# EAGLE design quadcopter (EAGLE 8.1.1)
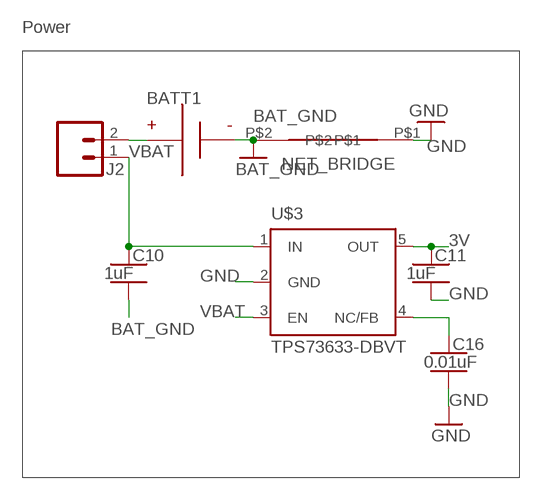
[diagram p0: schematic, sheet 1, part 1 of 2]
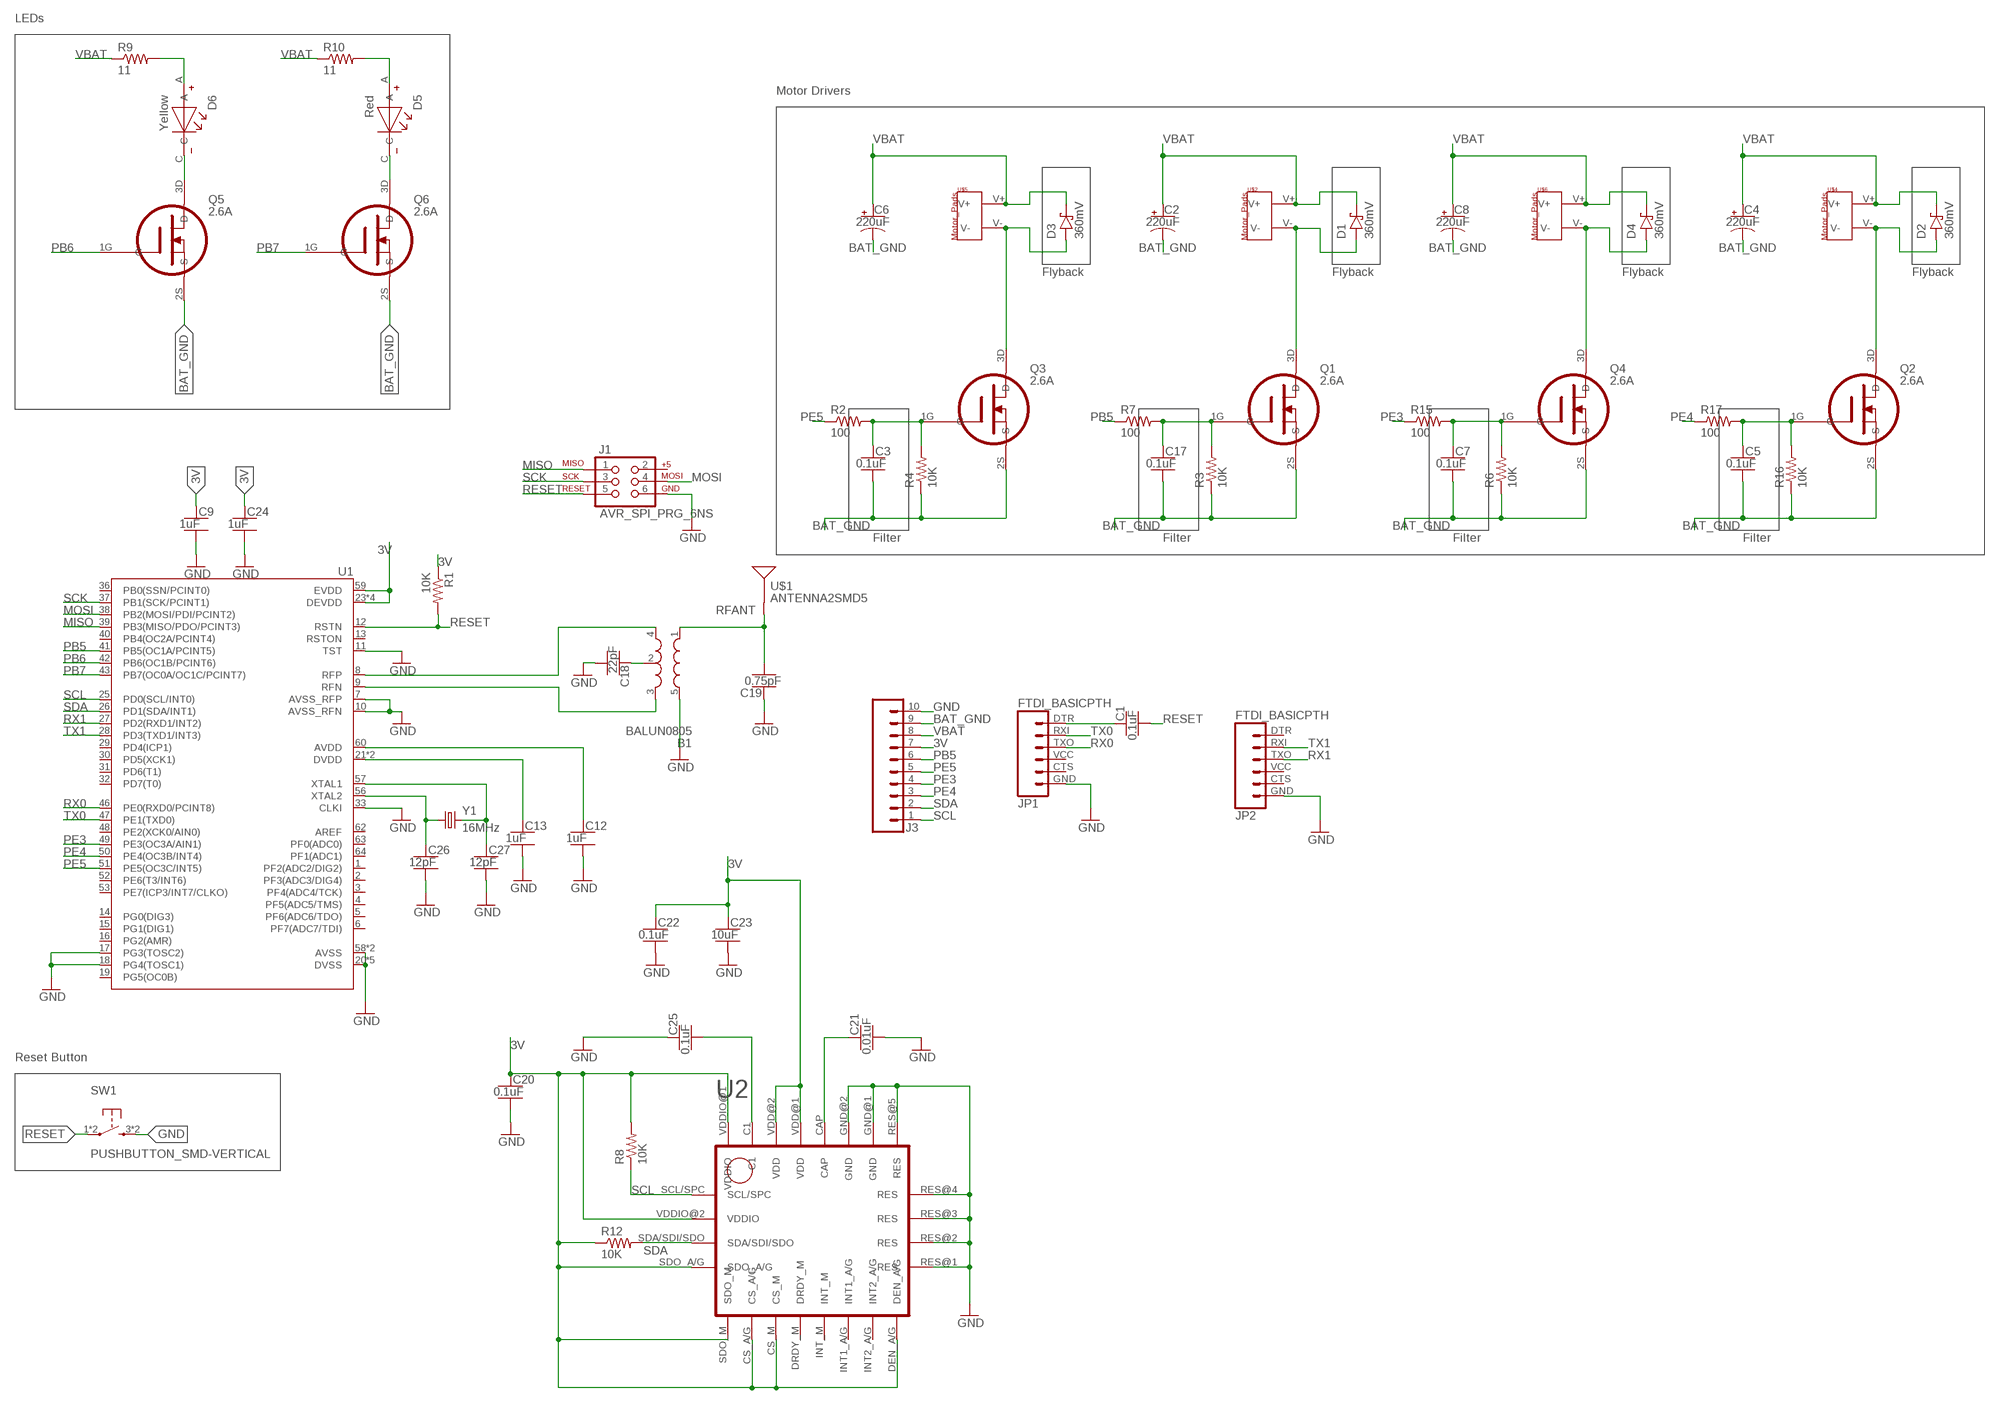
[diagram p1: schematic, sheet 1, part 2 of 2]

## Parts
B1  BALUN0805  [BALUN]
BATT1  BATTERY-HUBSAN-W/HOLDER  [BATTERY-W/HOLDER-380MAH-HUBSAN]
C1  0.1uF  CERAMIC_CAP-0805-0.1UF  [CERAMIC_CAP_0805]
C2  220uF  CAPACITOR-POL_SMD-7043-D_TANTALUM-220UF  [CAPMP7343X310_HS]
C3  0.1uF  CAPACITOR-NP_SMD-2012-0805_CERAMIC-0.1UF  [CAPC2012X140_HS]
C4  220uF  CAPACITOR-POL_SMD-7043-D_TANTALUM-220UF  [CAPMP7343X310_HS]
C5  0.1uF  CAPACITOR-NP_SMD-2012-0805_CERAMIC-0.1UF  [CAPC2012X140_HS]
C6  220uF  CAPACITOR-POL_SMD-7043-D_TANTALUM-220UF  [CAPMP7343X310_HS]
C7  0.1uF  CAPACITOR-NP_SMD-2012-0805_CERAMIC-0.1UF  [CAPC2012X140_HS]
C8  220uF  CAPACITOR-POL_SMD-7043-D_TANTALUM-220UF  [CAPMP7343X310_HS]
C9  1uF  CAPACITOR-NP_SMD-2012-0805_CERAMIC-1UF  [CAPC2012X140_HS]
C10  1uF  CAPACITOR-NP_SMD-2012-0805_CERAMIC-1UF  [CAPC2012X140_HS]
C11  1uF  CAPACITOR-NP_SMD-2012-0805_CERAMIC-1UF  [CAPC2012X140_HS]
C12  1uF  CAPACITOR-NP_SMD-2012-0805_CERAMIC-1UF  [CAPC2012X140_HS]
C13  1uF  CAPACITOR-NP_SMD-2012-0805_CERAMIC-1UF  [CAPC2012X140_HS]
C16  0.01uF  CAPACITOR-NP_SMD-2012-0805_CERAMIC-0.01UF  [CAPC2012X140_HS]
C17  0.1uF  CAPACITOR-NP_SMD-2012-0805_CERAMIC-0.1UF  [CAPC2012X140_HS]
C18  22pF  CAPACITOR-NP_SMD-2012-0805_CERAMIC-22PF  [CAPC2012X140_HS]
C19  0.75pF  CAPACITOR-NP_SMD-2012-0805_CERAMIC-0.75PF  [CAPC2012X140_HS]
C20  0.1uF  CAPACITOR-NP_SMD-2012-0805_CERAMIC-0.1UF  [CAPC2012X140_HS]
C21  0.01uF  CAPACITOR-NP_SMD-2012-0805_CERAMIC-0.01UF  [CAPC2012X140_HS]
C22  0.1uF  CAPACITOR-NP_SMD-2012-0805_CERAMIC-0.1UF  [CAPC2012X140_HS]
C23  10uF  CAPACITOR-NP_SMD-2012-0805_CERAMIC-10UF  [CAPC2012X140_HS]
C24  1uF  CAPACITOR-NP_SMD-2012-0805_CERAMIC-1UF  [CAPC2012X140_HS]
C25  0.1uF  CAPACITOR-NP_SMD-2012-0805_CERAMIC-0.1UF  [CAPC2012X140_HS]
C26  12pF  CAPACITOR-NP_SMD-2012-0805_CERAMIC-12PF  [CAPC2012X140_HS]
C27  12pF  CAPACITOR-NP_SMD-2012-0805_CERAMIC-12PF  [CAPC2012X140_HS]
D1  360mV  DIODE-SCHOTTKY_SMD-SOD123-360MV  [SOD3716X135_HS]
D2  360mV  DIODE-SCHOTTKY_SMD-SOD123-360MV  [SOD3716X135_HS]
D3  360mV  DIODE-SCHOTTKY_SMD-SOD123-360MV  [SOD3716X135_HS]
D4  360mV  DIODE-SCHOTTKY_SMD-SOD123-360MV  [SOD3716X135_HS]
D5  Red  LED_VLMX51Z1AARED  [LED_VLMX51Z1AA]
D6  Yellow  LED_VLMX51Z1AAYELLOW  [LED_VLMX51Z1AA]
J1  AVR_SPI_PRG_6NS  [2X3-NS]
J2  MALE_HEADER_2POS-2X1-0.1IN  [MALE_HEADER_2X1_0.1IN]
J3  SIP-10_TH-254X10  [HDRV10W63P254_10X1_2540X254H838_HS]
JP1  FTDI_BASICPTH  [FTDI_BASIC]
JP2  FTDI_BASICPTH  [FTDI_BASIC]
NET_BRIDGE  NET_BRIDGE  [NET_BRIDGE]
Q1  2.6A  N_MOSFET_SI2302CDS_T1_E3  [N_MOSFET_SI2302CDS_T1_E3]
Q2  2.6A  N_MOSFET_SI2302CDS_T1_E3  [N_MOSFET_SI2302CDS_T1_E3]
Q3  2.6A  N_MOSFET_SI2302CDS_T1_E3  [N_MOSFET_SI2302CDS_T1_E3]
Q4  2.6A  N_MOSFET_SI2302CDS_T1_E3  [N_MOSFET_SI2302CDS_T1_E3]
Q5  2.6A  N_MOSFET_SI2302CDS_T1_E3  [N_MOSFET_SI2302CDS_T1_E3]
Q6  2.6A  N_MOSFET_SI2302CDS_T1_E3  [N_MOSFET_SI2302CDS_T1_E3]
R1  10K  RESISTOR_SMD-2012-0805-10K  [RESC2012X60_HS]
R2  100  RESISTOR_SMD-2012-0805-100  [RESC2012X60_HS]
R3  10K  RESISTOR_SMD-2012-0805-10K  [RESC2012X60_HS]
R4  10K  RESISTOR_SMD-2012-0805-10K  [RESC2012X60_HS]
R6  10K  RESISTOR_SMD-2012-0805-10K  [RESC2012X60_HS]
R7  100  RESISTOR_SMD-2012-0805-100  [RESC2012X60_HS]
R8  10K  RESISTOR_SMD-2012-0805-10K  [RESC2012X60_HS]
R9  11  RESISTOR_SMD-2012-0805-11  [RESC2012X60_HS]
R10  11  RESISTOR_SMD-2012-0805-11  [RESC2012X60_HS]
R12  10K  RESISTOR_SMD-2012-0805-10K  [RESC2012X60_HS]
R15  100  RESISTOR_SMD-2012-0805-100  [RESC2012X60_HS]
R16  10K  RESISTOR_SMD-2012-0805-10K  [RESC2012X60_HS]
R17  100  RESISTOR_SMD-2012-0805-100  [RESC2012X60_HS]
SW1  PUSHBUTTON_SMD-VERTICAL  [TE_FSM8JSMA_HS]
U1  ATMEGA128RFA1  [QFN-64]
U2  IMU_LSM9DS1TR  [IMU_LSM9DS1TR]
U$1  ANTENNA2SMD5  [ANTENNA-CHIP5]
U$2  MOTOR_PADS  [MOTOR_PADS]
U$3  TPS73633-DBVT  [SOT23-DBV]
U$4  MOTOR_PADS  [MOTOR_PADS]
U$5  MOTOR_PADS  [MOTOR_PADS]
U$6  MOTOR_PADS  [MOTOR_PADS]
Y1  16MHz  CRYSTAL5X3  [CRYSTAL-SMD-5X3]

## Nets
3V: C9.1 C11.1 C20.1 C22.1 C23.1 C24.1 J3.7 R1.1 R8.2 R12.1 U1.23(DEVDD) U1.34(DEVDD) U1.44(DEVDD) U1.54(DEVDD) U1.59(EVDD) U2.CS_A/G U2.CS_M U2.DEN_A/G U2.SDO_A/G U2.SDO_M U2.VDD@1(VDD) U2.VDD@2(VDD) U2.VDDIO@1(VDDIO) U2.VDDIO@2(VDDIO) U$3.5(OUT)
BAT_GND [HIGHCURRENT]: BATT1.-(N) C2.2(-) C3.2 C4.2(-) C5.2 C6.2(-) C7.2 C8.2(-) C10.2 C17.2 J3.9 NET_BRIDGE.P$2 Q1.2S(S) Q2.2S(S) Q3.2S(S) Q4.2S(S) Q5.2S(S) Q6.2S(S) R3.1 R4.1 R6.1 R16.1
FILTERED [HIGHCURRENT]: C7.1 Q4.1G(G) R6.2 R15.2
GND: B1.5(GND) C9.2 C11.2 C12.2 C13.2 C16.2 C18.2 C19.1 C20.2 C21.2 C22.2 C23.2 C24.2 C25.1 C26.2 C27.2 J1.6 J3.10 JP1.GND JP2.GND NET_BRIDGE.P$1 SW1.3 SW1.4 U1.7(AVSS_RFP) U1.10(AVSS_RFN) U1.11(TST) U1.17(PG3(TOSC2)) U1.18(PG4(TOSC1)) U1.20(DVSS) U1.24(DVSS) U1.33(CLKI) U1.35(DVSS) U1.45(DVSS) U1.55(DVSS) U1.58(AVSS) U1.61(AVSS) U2.GND@1(GND) U2.GND@2(GND) U2.RES@1(RES) U2.RES@2(RES) U2.RES@3(RES) U2.RES@4(RES) U2.RES@5(RES) U$3.2(GND)
MISO: J1.1 U1.39(PB3(MISO/PDO/PCINT3))
MOSI: J1.4 U1.38(PB2(MOSI/PDI/PCINT2))
N$1: C1.1 JP1.DTR
N$2 [HIGHCURRENT]: D6.C Q5.3D(D)
N$3 [HIGHCURRENT]: D6.A R9.2
N$4 [HIGHCURRENT]: D5.C Q6.3D(D)
N$5: C27.1 U1.57(XTAL1) Y1.3
N$6 [HIGHCURRENT]: D5.A R10.2
N$10: C12.1 U1.60(AVDD)
N$13: C13.1 U1.21(DVDD) U1.22(DVDD)
N$14: C26.1 U1.56(XTAL2) Y1.1
N$15: C25.2 U2.C1
N$16 [HIGHCURRENT]: D1.A Q1.3D(D) U$2.V-
N$17: C21.1 U2.CAP
N$21: B1.4(OUT1) U1.8(RFP)
N$22: B1.3(OUT2) U1.9(RFN)
N$23 [HIGHCURRENT]: BATT1.+(P) J2.2
N$24 [HIGHCURRENT]: D3.A Q3.3D(D) U$5.V-
N$25: B1.2(GND) C18.1
N$29 [HIGHCURRENT]: D4.A Q4.3D(D) U$6.V-
N$30 [HIGHCURRENT]: D2.A Q2.3D(D) U$4.V-
N$31 [HIGHCURRENT]: C3.1 Q3.1G(G) R2.2 R4.2
N$32: C16.1 U$3.4(NC/FB)
N$33 [HIGHCURRENT]: C17.1 Q1.1G(G) R3.2 R7.2
N$34 [HIGHCURRENT]: C5.1 Q2.1G(G) R16.2 R17.2
PB5: J3.6 R7.1 U1.41(PB5(OC1A/PCINT5))
PB6: Q5.1G(G) U1.42(PB6(OC1B/PCINT6))
PB7: Q6.1G(G) U1.43(PB7(OC0A/OC1C/PCINT7))
PE3: J3.4 R15.1 U1.49(PE3(OC3A/AIN1))
PE4: J3.3 R17.1 U1.50(PE4(OC3B/INT4))
PE5: J3.5 R2.1 U1.51(PE5(OC3C/INT5))
RESET: C1.2 J1.5 R1.2 SW1.1 SW1.2 U1.12(RSTN)
RFANT [RFSIG]: B1.1(IN) C19.2 U$1.FEED(SIGNAL)
RX0: JP1.TXO U1.46(PE0(RXD0/PCINT8))
RX1: JP2.TXO U1.27(PD2(RXD1/INT2))
SCK: J1.3 U1.37(PB1(SCK/PCINT1))
SCL: J3.1 R8.1 U1.25(PD0(SCL/INT0)) U2.SCL/SPC
SDA: J3.2 R12.2 U1.26(PD1(SDA/INT1)) U2.SDA/SDI/SDO
TX0: JP1.RXI U1.47(PE1(TXD0))
TX1: JP2.RXI U1.28(PD3(TXD1/INT3))
VBAT [HIGHCURRENT]: C2.1(+) C4.1(+) C6.1(+) C8.1(+) C10.1 D1.C D2.C D3.C D4.C J2.1 J3.8 R9.1 R10.1 U$2.V+ U$3.1(IN) U$3.3(EN) U$4.V+ U$5.V+ U$6.V+
Unconnected: J1.2 JP1.CTS JP1.VCC JP2.CTS JP2.DTR JP2.VCC U1.1(PF2(ADC2/DIG2)) U1.2(PF3(ADC3/DIG4)) U1.3(PF4(ADC4/TCK)) U1.4(PF5(ADC5/TMS)) U1.5(PF6(ADC6/TDO)) U1.6(PF7(ADC7/TDI)) U1.13(RSTON) U1.14(PG0(DIG3)) U1.15(PG1(DIG1)) U1.16(PG2(AMR)) U1.19(PG5(OC0B)) U1.29(PD4(ICP1)) U1.30(PD5(XCK1)) U1.31(PD6(T1)) U1.32(PD7(T0)) U1.36(PB0(SSN/PCINT0)) U1.40(PB4(OC2A/PCINT4)) U1.48(PE2(XCK0/AIN0)) U1.52(PE6(T3/INT6)) U1.53(PE7(ICP3/INT7/CLKO)) U1.62(AREF) U1.63(PF0(ADC0)) U1.64(PF1(ADC1)) U2.DRDY_M U2.INT1_A/G U2.INT2_A/G U2.INT_M

## Notes on the sheet
- LEDs
- Motor Drivers
- Flyback | Flyback | Flyback | Flyback
- Power
- Filter | Filter | Filter | Filter
- Reset Button

## Library data of the parts
B1 = quadparts_prebuilt:BALUN: 0805 footprint balun- Ember 351/357; DATASHEET: http://katalog.we-online.de/pbs/datasheet/748421245.pdf; DIST: Digikey; DISTPN: 732-2230-6-ND; MFR: Wurth Electronics Inc; MPN: 748421245; PRICE: 2.63
BATT1 = quadparts_prebuilt:BATTERY; CREATOR: Swanson; DIST: AMAZON; DISTPN: http://www.amazon.com/dp/B00RROB6Q4?smid=AMNTPWSAB5H0S; MFR: HUBSAN; MPN: X4-H107C-8-in-1
C1 = quadparts_connie:CERAMIC_CAP: Nonpolarized capacitor; CREATOR: SWANSON; DIST: Digikey; DISTPN: 490-1666-1-ND; MFR: Murata Electronics North America; MPN: GRM21BR71H104KA01L
C2 C4 C6 C8 = quadparts_prebuilt:CAPACITOR-POL_: Polarized capacitor; DIST: Digikey; DISTPN: 478-8912-1-ND; MFR: AVX Corporation; MPN: TAJD227K006RNJ
C3 C5 C7 C17 C20 C22 C25 = quadparts_prebuilt:CAPACITOR-NP_: Nonpolarized capacitor; DIST: Digikey; DISTPN: 490-1666-1-ND; MFR: Murata Electronics North America; MPN: GRM21BR71H104KA01L
C9-C13 C24 = quadparts_prebuilt:CAPACITOR-NP_: Nonpolarized capacitor; DIST: Digikey; DISTPN: 490-4736-1-ND; MFR: Murata Electronics North America; MPN: GRM21BR71H105KA12L
C16 C21 = quadparts_prebuilt:CAPACITOR-NP_: Nonpolarized capacitor; DIST: Digikey; DISTPN: 490-8295-1-ND; MFR: Murata Electronics North America; MPN: GRM2195C1H103FA01D
C18 = quadparts_prebuilt:CAPACITOR-NP_: Nonpolarized capacitor; DIST: Digikey; DISTPN: 490-5534-1-ND; MFR: Murata Electronics North America; MPN: GRM21A5C2E220JW01D
C19 = quadparts_prebuilt:CAPACITOR-NP_: Nonpolarized capacitor; DIST: Digikey; DISTPN: 490-3585-1-ND; MFR: Murata Electronics North America; MPN: GQM2195C2AR75CB01D
C23 = quadparts_prebuilt:CAPACITOR-NP_: Nonpolarized capacitor; DIST: Digikey; DISTPN: 490-5523-1-ND; MFR: Murata Electronics North America; MPN: GRM21BR61E106KA73L
C26 C27 = quadparts_prebuilt:CAPACITOR-NP_: Nonpolarized capacitor; DIST: Digikey; DISTPN: 490-5531-1-ND; MFR: Murata Electronics North America; MPN: GRM21A5C2E120JW01D
D1-D4 = quadparts_prebuilt:DIODE-SCHOTTKY_: Schottky diode; DIST: Digikey; DISTPN: CRS08QMCT-ND; MFR: Toshiba Semiconductor and Storage; MPN: CRS08(TE85L,Q,M)
D5 = LEDs:LED_VLMX51Z1AA: 2.2V, 140mA test, 200mA max; CREATOR: Jason Shiuan; DIST: Digikey; DISTPN: VLMR51Z1AA-GS08CT-ND; MFR: Vishay; MPN: VLMR51Z1AA-GS08
D6 = LEDs:LED_VLMX51Z1AA: 2.2V, 140mA test, 200mA max; CREATOR: Jason Shiuan; DIST: Digikey; DISTPN: VLMY51Z1AA-GS08CT-ND; MFR: Vishay; MPN: VLMY51Z1AA-GS08
J1 = quadparts_prebuilt:AVR_SPI_PRG_6: AVR ISP 6 Pin This is the reduced ISP connector for AVR programming. Common on Arduino. This footprint will take up less PCB space and can be used with a 10-pin to 6-pin adapter such as SKU: BOB-08508; DATASHEET: http://portal.fciconnect.com/Comergent//fci/drawing/67996.pdf; DIST: Digikey; DISTPN: 609-3234-ND; MFR: Amphenol FCI; MPN: 67997-206HLF; PRICE: 0.31
J2 = quadparts_connie:MALE_HEADER_2POS: 2 pin single inline pin header, socket, or connector; CREATOR: SWANSON; DIST: Digikey; DISTPN: 3M9447-ND; MFR: 3M; MPN: 961102-6404-AR
J3 = quadparts_prebuilt:SIP-10_: 10 pin single inline pin header, socket, or connector; DATASHEET: http://portal.fciconnect.com/Comergent//fci/drawing/68000.pdf; DIST: Digikey; DISTPN: 609-3250-ND; MFR: Amphenol FCI; MPN: 68000-110HLF; PRICE: 0.55
JP1 JP2 = quadparts_prebuilt:FTDI_BASIC: FTDI Basic header with labels; DATASHEET: http://portal.fciconnect.com/Comergent//fci/drawing/68015.pdf; DIST: Digikey; DISTPN: 609-3327-ND; MFR: Amphenol FCI; MPN: 68016-406HLF; PRICE: 0.33
NET_BRIDGE = quadparts_jason:NET_BRIDGE; CREATPR: Jason Shiuan
Q1-Q6 = quadparts_connie:N_MOSFET_SI2302CDS_T1_E3; CREATOR: Connie Du; DIST: Digikey; DISTPN: SI2302CDS-T1-E3CT-ND; MFR: Vishay Siliconix; MPN: SI2302CDS-T1-E3
R1 R3 R4 R6 R8 R12 R16 = quadparts_prebuilt:RESISTOR_: Resistor; DIST: Digikey; DISTPN: 311-10KARCT-ND; MFR: Yageo; MPN: RC0805JR-0710KL
R2 R7 R15 R17 = quadparts_prebuilt:RESISTOR_: Resistor; DIST: Digikey; DISTPN: 311-100ARCT-ND; MFR: Yageo; MPN: RC0805JR-07100RL
R9 R10 = quadparts_prebuilt:RESISTOR_: Resistor; DIST: Digikey; DISTPN: 311-11.0FRCT-ND; MFR: Yageo; MPN: RC1206FR-0711RL
SW1 = quadparts_prebuilt:PUSHBUTTON_: Pushbutton with 2 pins shorting 1 to 2 and two extra mounting pins 3 & 4
U1 = quadparts_prebuilt:ATMEGA128RFA1: ATmega128RFA1 8-bit AVR Microcontroller with Low Power 2.4GHz Transceiver for ZigBee and IEEE 802.15.4; CREATOR: Swanson; DATASHEET: http://www.atmel.com/Images/Atmel-8266-MCU_Wireless-ATmega128RFA1_Datasheet.pdf; DIST: Digikey; DISTPN: ATMEGA128RFA1-ZUR00DKR-ND; MFR: Atmel; MPN: ATMEGA128RFA1-ZUR00; PRICE: 10.21
U2 = quadparts_connie:IMU_LSM9DS1TR; CREATOR: Connie Du; DIST: Digikey; DISTPN: 497-14946-1-ND; MFR: STMicroelectronics; MPN: LSM9DS1TR
U$1 = quadparts_prebuilt:ANTENNA2: Chip antenna Single endded antenna. Common with smaller chip antennas. CHIP4 package is the GPS Chip Antenna SKU: GPS-08418. CHIP5 package is 2.4GHz chip antenna SKU: WRL-00144.; DATASHEET: http://www.linxtechnologies.com/resources/data-guides/ant-xxx-chp-x.pdf; DIST: Digikey; DISTPN: ANT-2.45-CHPCT-ND; MFR: Linx Technologies Inc.; MPN: ANT-2.45-CHP-T; PRICE: 3.16
U$2 U$4-U$6 = quadparts_prebuilt:MOTOR_PADS; DIST: NA; DISTPN: NA; MFR: NA; MPN: NA
U$3 = quadparts_prebuilt:TPS73633-DBVT; DATASHEET: http://www.ti.com/lit/ds/symlink/lp3985.pdf; DIST: Digikey; DISTPN: LP3985IM5X-3.0/NOPBCT-ND; MFR: Texas Instruments; MPN: LP3985IM5X-3.0/NOPB; PRICE: 0.59
Y1 = quadparts_prebuilt:CRYSTAL: Various standard crystals. Proven footprints.; DATASHEET: http://www.abracon.com/Resonators/abm3b.pdf; DIST: Digikey; DISTPN: 535-9122-1-ND; MFR: Abracon LLC; MPN: ABM3B-16.000MHZ-B2-T; PRICE: 0.68; PROD_ID: XTAL-08218

## Net classes
1 RFSIG: width 0.457 mm
2 HIGHCURRENT: width 0.457 mm

## Board
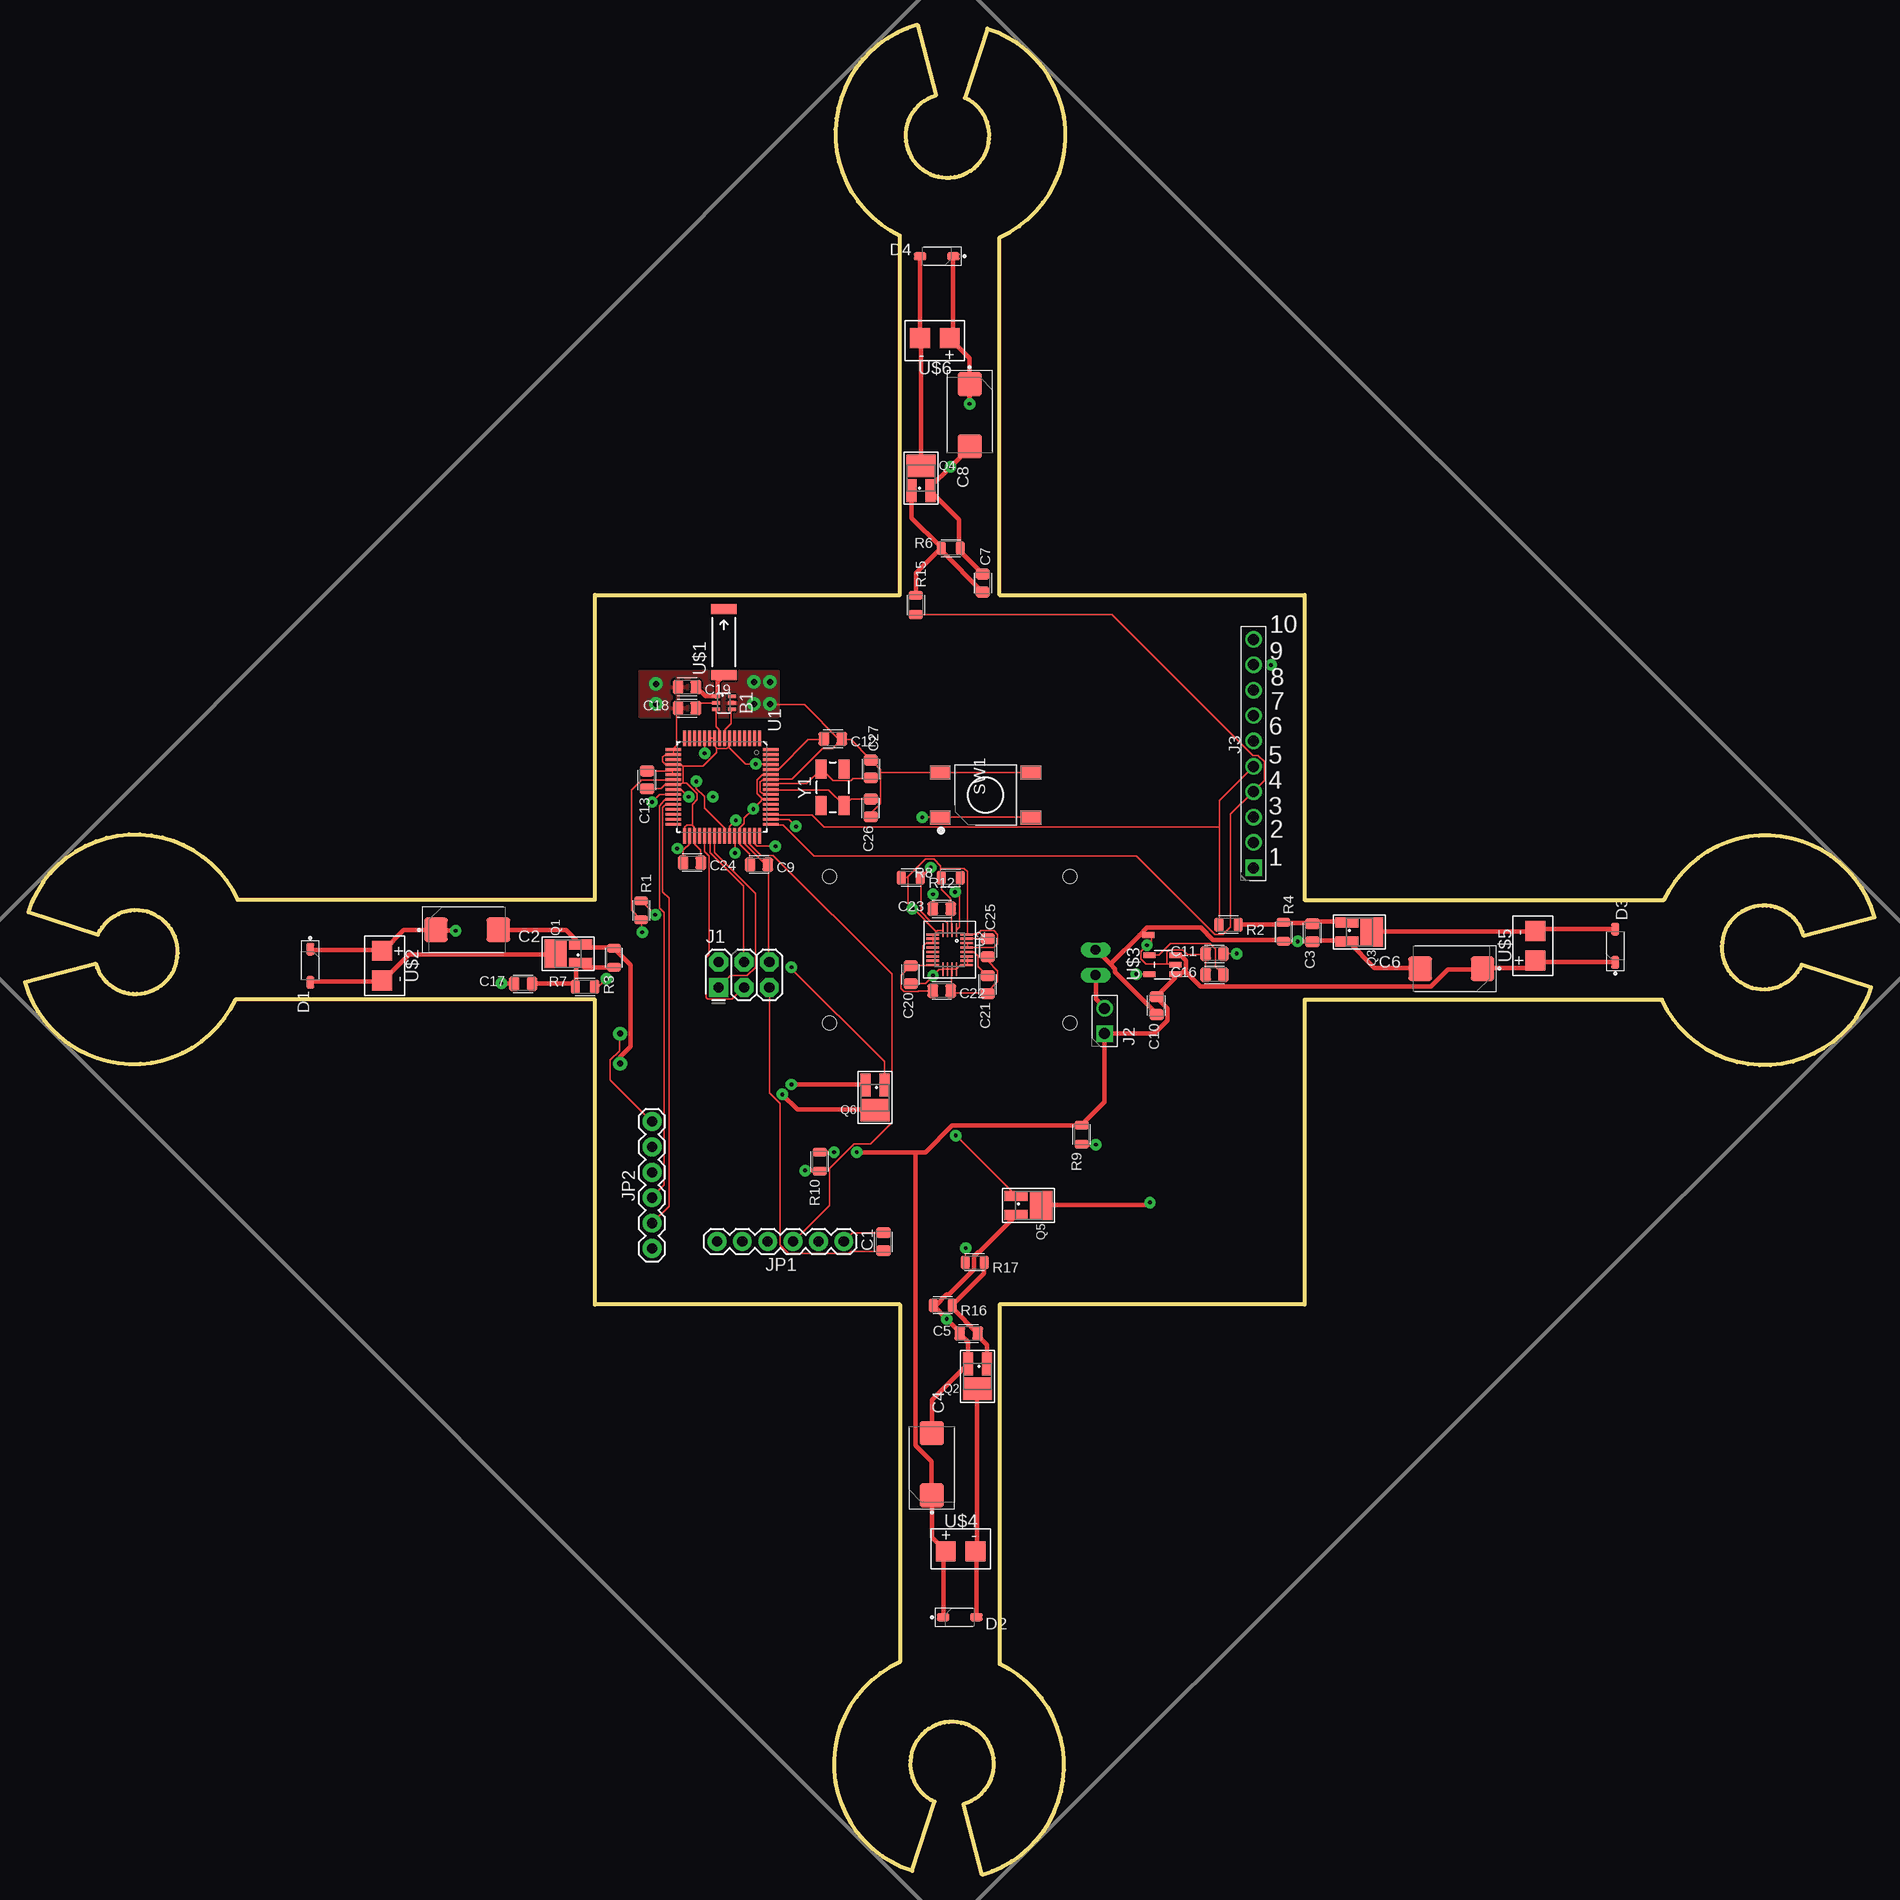
[diagram p2: board, top side]
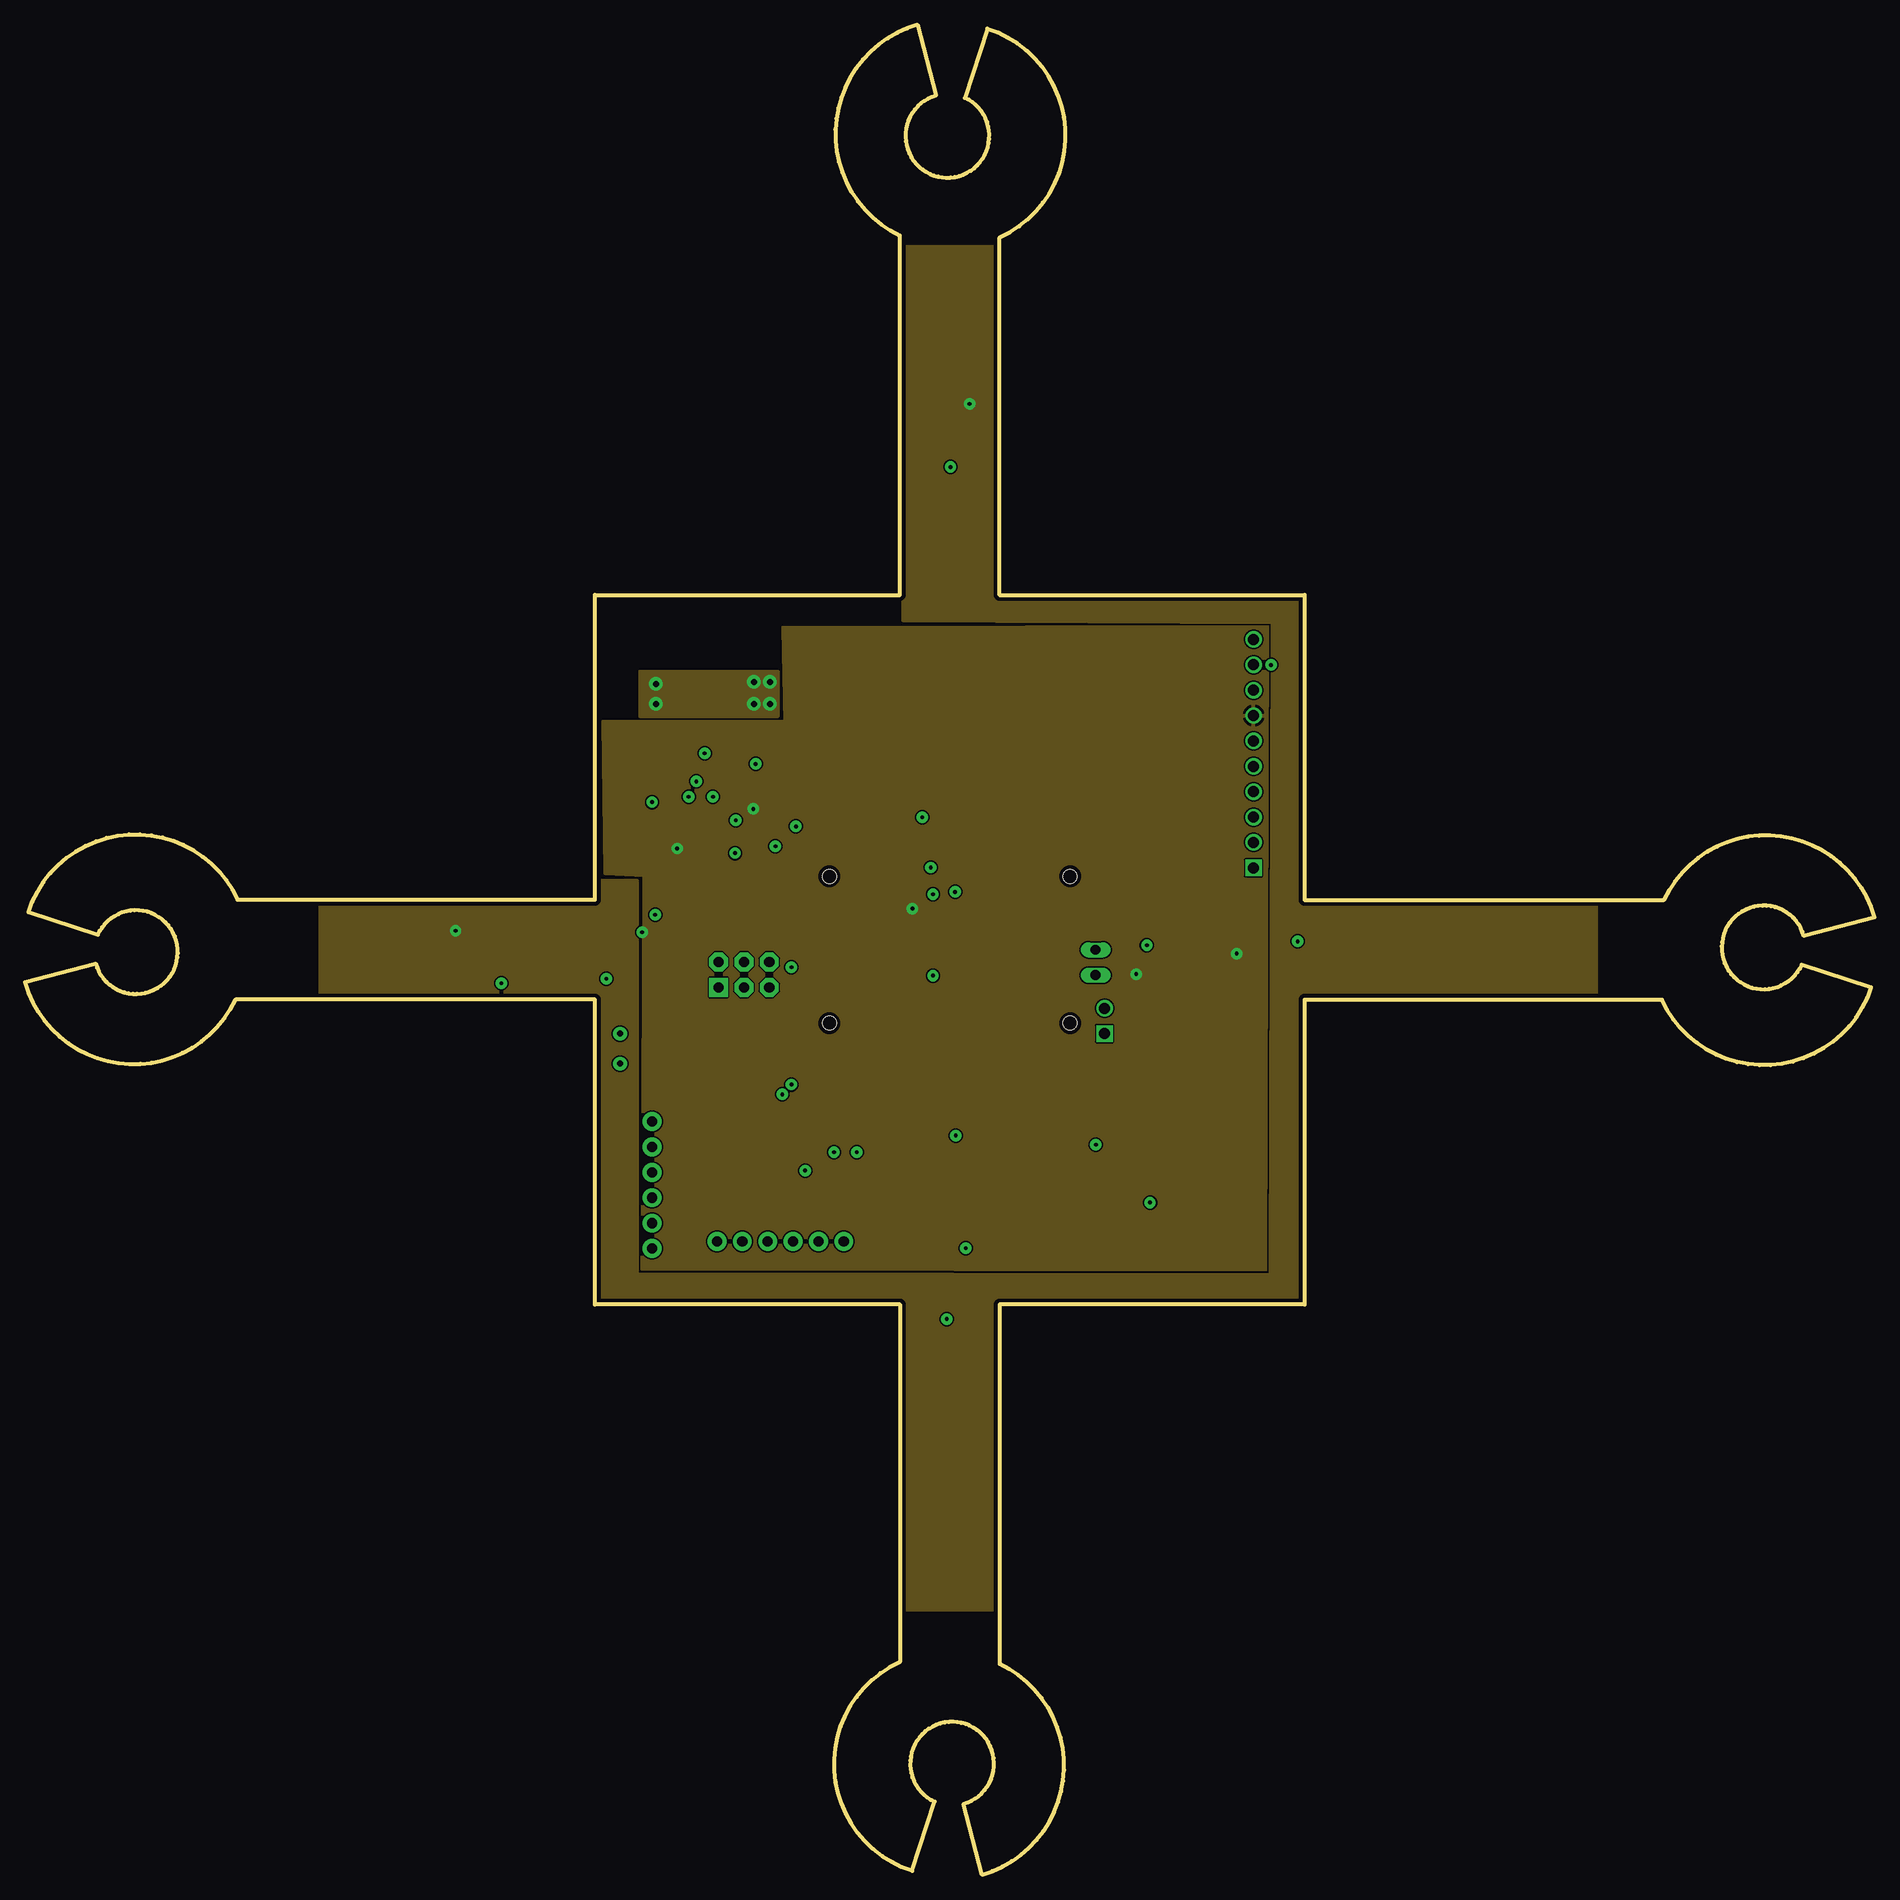
[diagram p3: board, inner layer Route2]
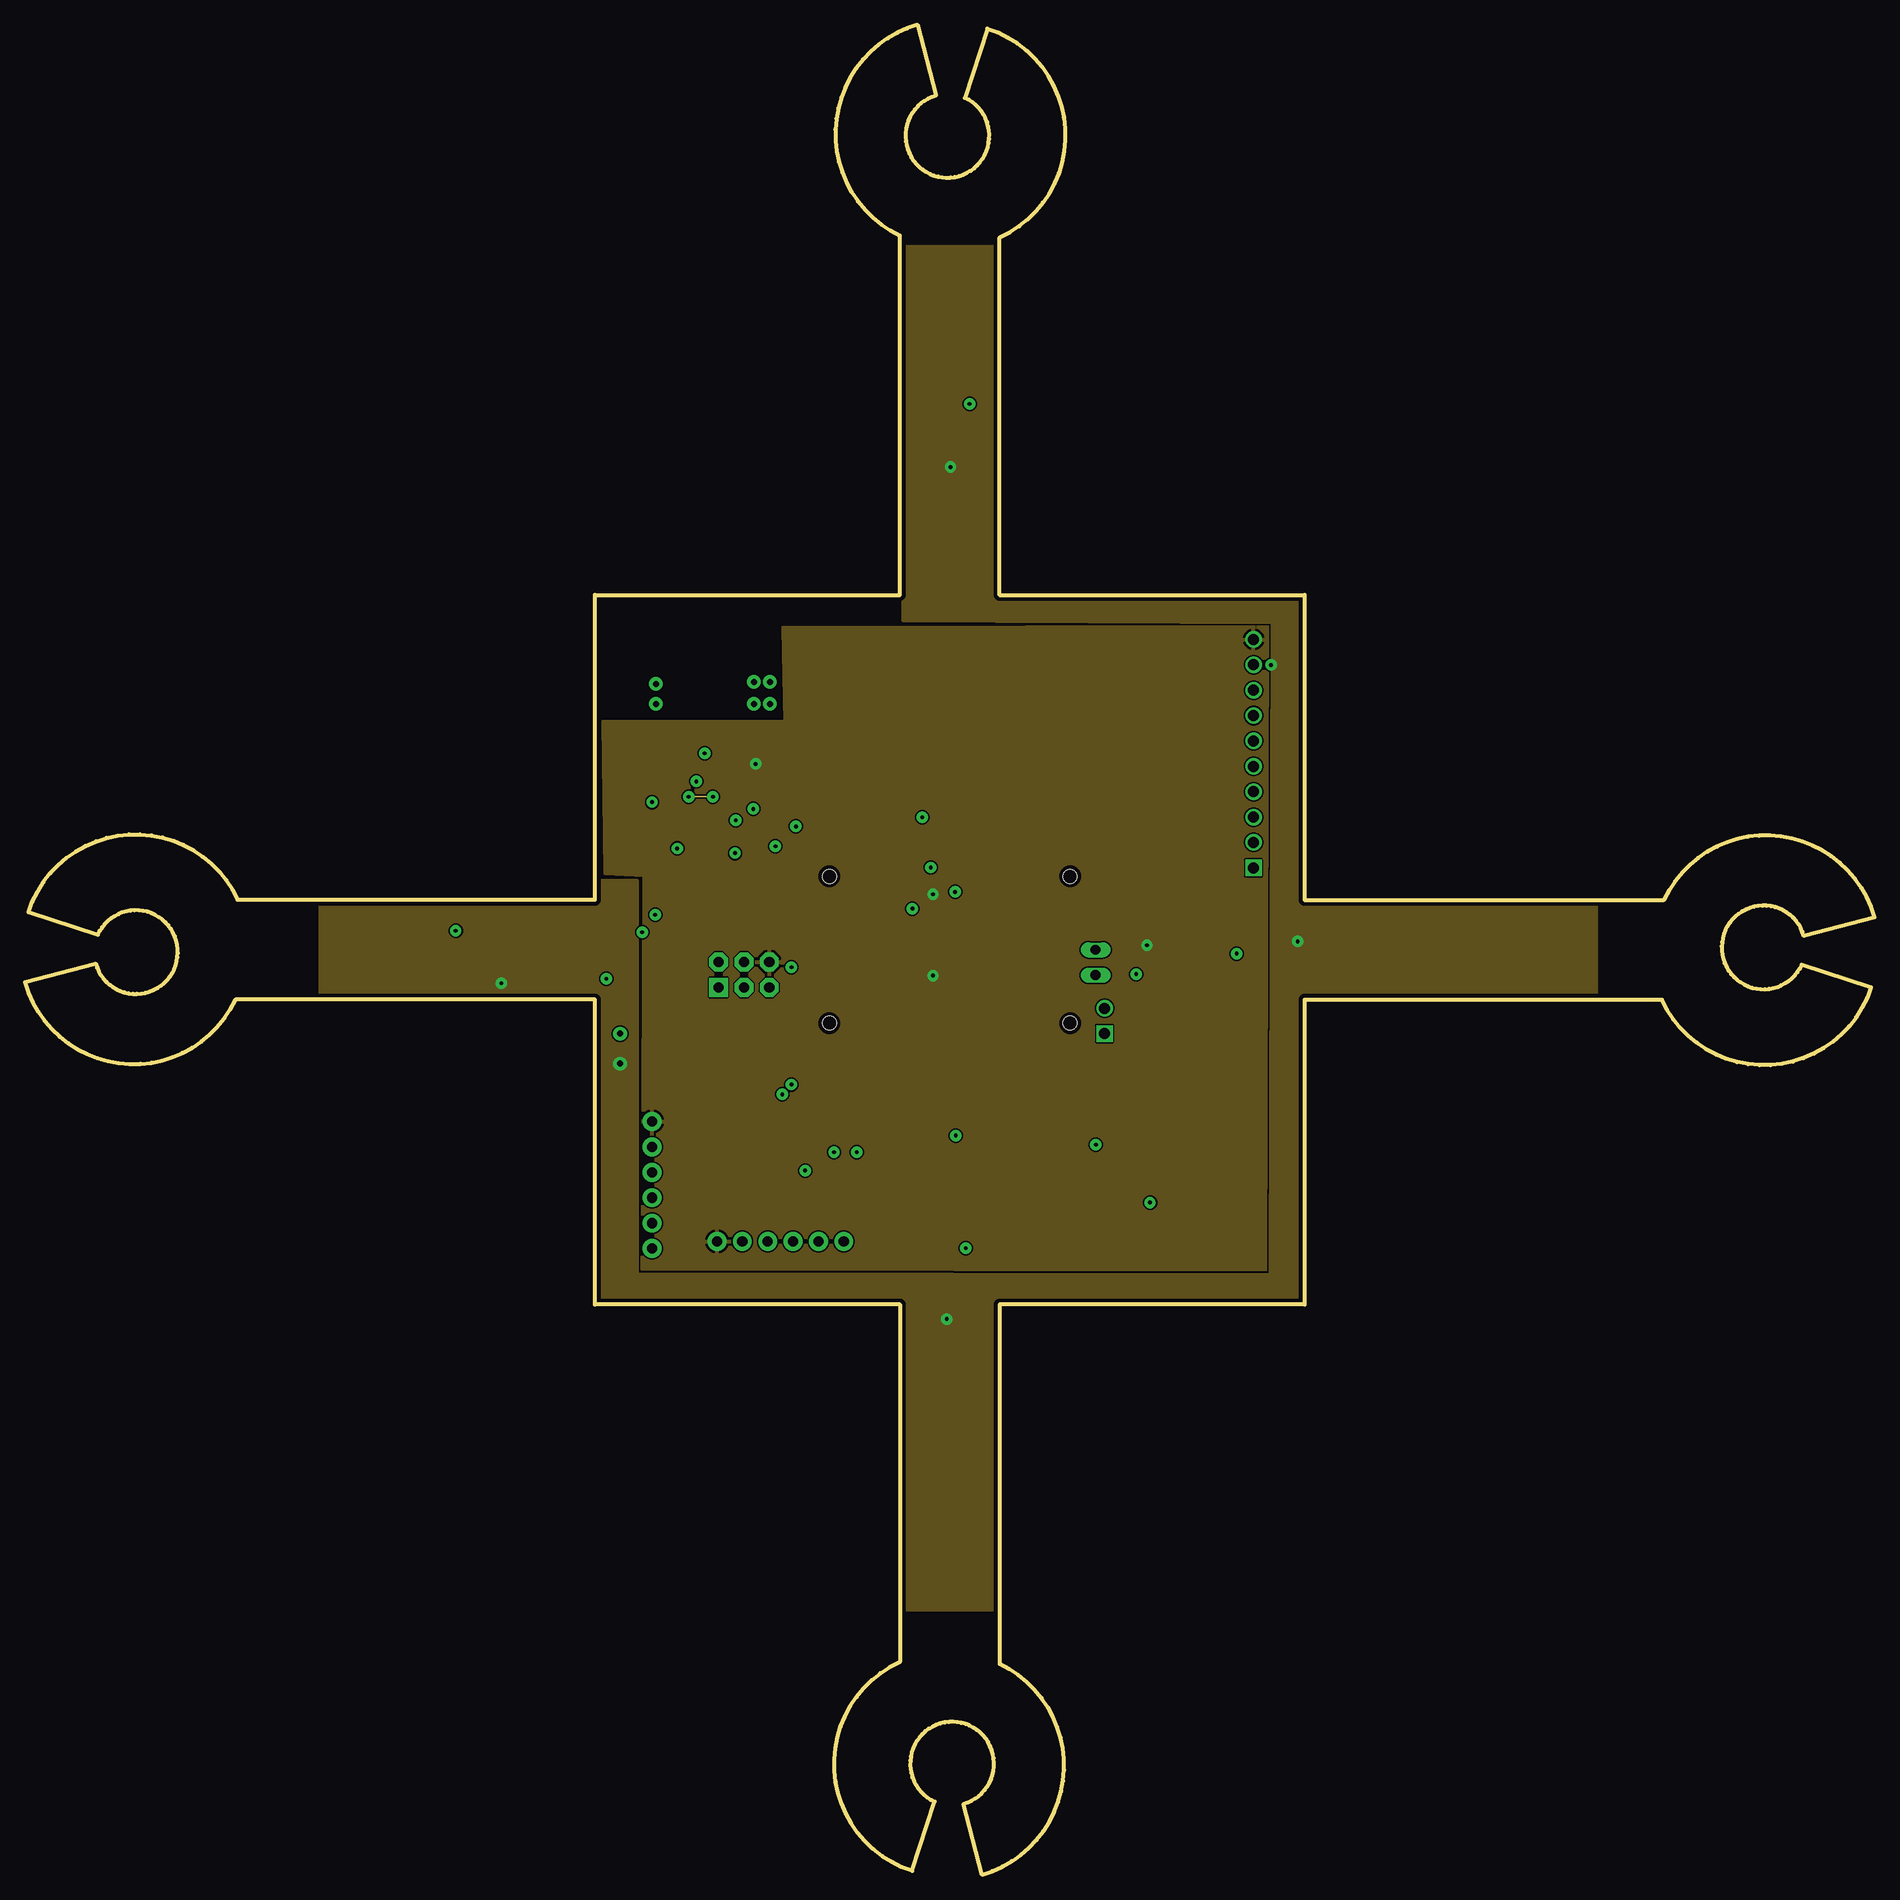
[diagram p4: board, inner layer Route15]
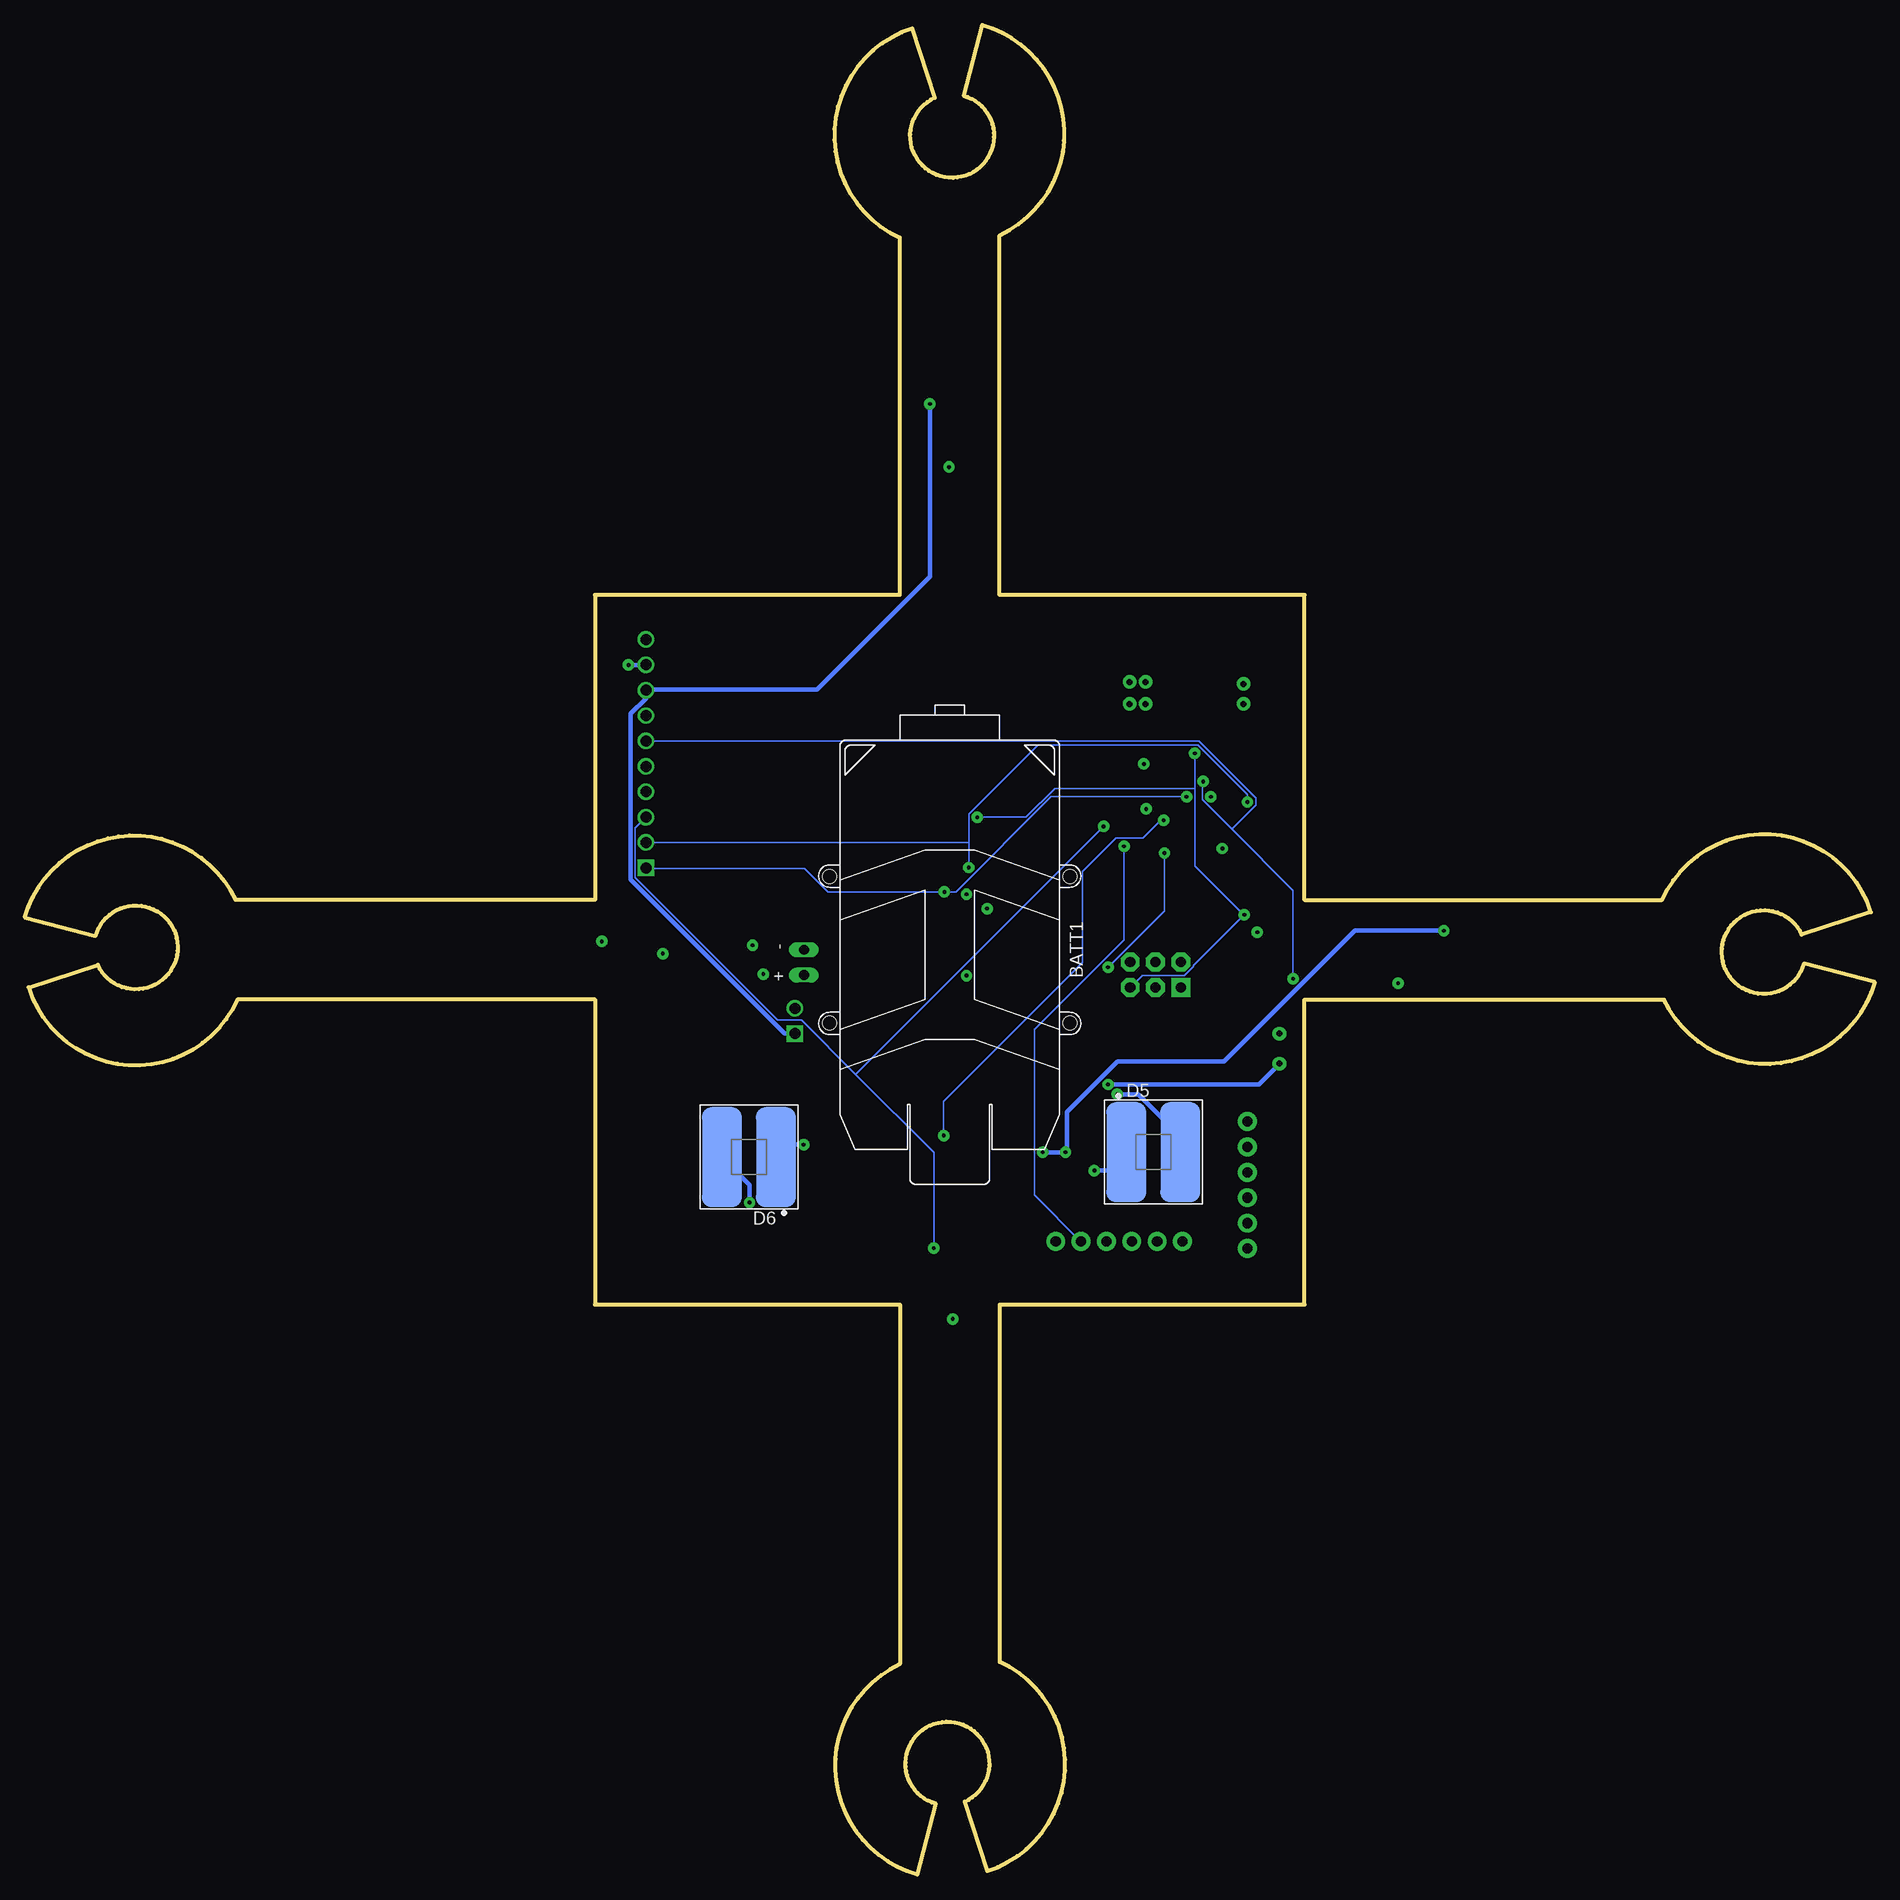
[diagram p5: board, bottom side, seen from below]

Size 185.12 x 185.12 mm. Coordinates in mm from the lower left corner, seen from the top.
Outline: 128.06,87.56 163.84,87.56 arc138 184.77,88.79 177.84,91.06 arc-319 178.05,93.95 185.12,95.79 arc139 164.05,97.56 128.06,97.56 128.06,128.06 97.56,128.06 97.56,163.84 arc138 96.33,184.77 94.07,177.84 arc-319 91.17,178.05 89.33,185.12 arc139 87.56,164.05 87.56,128.06 57.06,128.06 57.06,97.56 21.28,97.56 arc138 0.35,96.33 7.28,94.07 arc-319 7.07,91.17 0,89.33 arc139 21.07,87.56 57.06,87.56 57.06,57.06 87.56,57.06 87.56,21.28 arc138 88.79,0.35 91.06,7.28 arc-319 93.95,7.07 95.79,0 arc139 97.56,21.07 97.56,57.06 128.06,57.06 128.06,87.56
Copper layers (1*2*15*16): Top 0.035559375mm / dielectric 1.501140625mm / Route2 0.035559375mm / dielectric 0.149859375mm / Route15 0.035559375mm / dielectric 0.200659375mm / Bottom 0.035559375mm
Design rules "jason_connie_4pcb-66board": minimum track width 6mil, minimum drill 15mil, track to track 6mil, track to pad 6mil, pad to pad 6mil, via to via 6mil, smd to smd 6mil, copper to edge 15mil, drill to drill 10mil, minimum pad ring 10mil, minimum via ring 15mil, stop-mask expansion 4mil, vias tented up to drill 0mil, thermal gap 10mil
tRestrict: area 91.9,91.7 to 93.3,93.5; area 57.8,121 to 75.2,127.8
bRestrict: area 91.9,91.7 to 93.3,93.5; area 57.8,121 to 75.2,127.8

### Footprints (pad centres in the part's own frame; a part is rotated, then mirrored left to right if it is on the bottom)
BALUN = smd 0.35 x 0.8: 1 -0.65,-0.8; 2 0,-0.8; 3 0.65,-0.8; 4 0.65,0.8; 5 0,0.8; 6 -0.65,0.8
BATTERY-W/HOLDER-380MAH-HUBSAN = drill 1 long: + -2.54,14.605; - 0,14.605 | hole 1.4: -7.35,-12.05; -7.35,12.05; 7.35,-12.05; 7.35,12.05
CERAMIC_CAP_0805 = smd 1.08 x 1.42: 1 -0.895,0; 2 0.895,0
CAPMP7343X310_HS = smd 2.37 x 2.43: 1 -3.12,0; 2 3.12,0
CAPC2012X140_HS = smd 1.08 x 1.42: 1 -0.895,0; 2 0.895,0
SOD3716X135_HS = smd 1.25 x 0.8: A 1.665,0; C -1.665,0
LED_VLMX51Z1AA = smd 4 x 10: A -2.7,0; C 2.7,0
2X3-NS = drill 1.016 pad 1.88 square: 1 -2.54,-1.27 | drill 1.016 pad 1.88 octagon: 2 -2.54,1.27; 3 0,-1.27; 4 0,1.27; 5 2.54,-1.27; 6 2.54,1.27
MALE_HEADER_2X1_0.1IN = drill 1.1 pad 1.65 square: 1 0,0 | drill 1.1 pad 1.65: 2 2.54,0
HDRV10W63P254_10X1_2540X254H838_HS = drill 1.1 pad 1.65 square: 1 0,0 | drill 1.1 pad 1.65: 2 2.54,0; 3 5.08,0; 4 7.62,0; 5 10.16,0; 6 12.7,0; 7 15.24,0; 8 17.78,0; 9 20.32,0; 10 22.86,0
FTDI_BASIC = drill 1.016 pad 1.88: CTS 10.16,0; DTR 0,0; GND 12.7,0; RXI 2.54,0; TXO 5.08,0; VCC 7.62,0
NET_BRIDGE = smd 0.6 x 0.6: P$1 -0.3,0; P$2 0.3,0
N_MOSFET_SI2302CDS_T1_E3 = smd 1 x 2.3: 1G -0.95,-1.25; 2S 0.95,-1.25 | smd 2.9 x 2.25: 3D 0,1.25
RESC2012X60_HS = smd 0.92 x 1.38: 1 -0.955,0; 2 0.955,0
TE_FSM8JSMA_HS = smd 1.4 x 2.1: 1 -2.25,4.55; 2 -2.25,-4.55; 3 2.25,4.55; 4 2.25,-4.55
QFN-64 = smd 1.562 x 0.28: 1 -4.881,3.75; 2 -4.881,3.25; 3 -4.881,2.75; 4 -4.881,2.25; 5 -4.881,1.75; 6 -4.881,1.25; 7 -4.881,0.75; 8 -4.881,0.25; 9 -4.881,-0.25; 10 -4.881,-0.75; 11 -4.881,-1.25; 12 -4.881,-1.75; 13 -4.881,-2.25; 14 -4.881,-2.75; 15 -4.881,-3.25; 16 -4.881,-3.75; 33 4.881,-3.75; 34 4.881,-3.25; 35 4.881,-2.75; 36 4.881,-2.25; 37 4.881,-1.75; 38 4.881,-1.25; 39 4.881,-0.75; 40 4.881,-0.25; 41 4.881,0.25; 42 4.881,0.75; 43 4.881,1.25; 44 4.881,1.75; 45 4.881,2.25; 46 4.881,2.75; 47 4.881,3.25; 48 4.881,3.75 | smd 0.28 x 1.562: 17 -3.75,-4.881; 18 -3.25,-4.881; 19 -2.75,-4.881; 20 -2.25,-4.881; 21 -1.75,-4.881; 22 -1.25,-4.881; 23 -0.75,-4.881; 24 -0.25,-4.881; 25 0.25,-4.881; 26 0.75,-4.881; 27 1.25,-4.881; 28 1.75,-4.881; 29 2.25,-4.881; 30 2.75,-4.881; 31 3.25,-4.881; 32 3.75,-4.881; 49 3.75,4.881; 50 3.25,4.881; 51 2.75,4.881; 52 2.25,4.881; 53 1.75,4.881; 54 1.25,4.881; 55 0.75,4.881; 56 0.25,4.881; 57 -0.25,4.881; 58 -0.75,4.881; 59 -1.25,4.881; 60 -1.75,4.881; 61 -2.25,4.881; 62 -2.75,4.881; 63 -3.25,4.881; 64 -3.75,4.881
IMU_LSM9DS1TR = smd 0.23 x 1.4: C1 -1.1,1.7; CAP 0.22,1.7; CS_A/G -1.1,-1.7; CS_M -0.66,-1.7; DEN_A/G 1.54,-1.7; DRDY_M -0.22,-1.7; GND@1 1.1,1.7; GND@2 0.66,1.7; INT1_A/G 0.66,-1.7; INT2_A/G 1.1,-1.7; INT_M 0.22,-1.7; RES@5 1.54,1.7; SDO_M -1.54,-1.7; VDD@1 -0.22,1.7; VDD@2 -0.66,1.7; VDDIO@1 -1.54,1.7 | smd 1.4 x 0.23: RES@1 1.95,-0.67; RES@2 1.95,-0.223; RES@3 1.95,0.223; RES@4 1.95,0.67; SCL/SPC -1.95,0.67; SDA/SDI/SDO -1.95,-0.223; SDO_A/G -1.95,-0.67; VDDIO@2 -1.95,0.223
ANTENNA-CHIP5 = smd 1.016 x 2.54: FEED -3.302,0; NC 3.302,0
MOTOR_PADS = smd 2 x 2: V+ -1,0; V- 2,0
SOT23-DBV = smd 0.55 x 1.2: 1 -0.95,-1.3; 2 0,-1.3; 3 0.95,-1.3; 4 0.95,1.3; 5 -0.95,1.3
CRYSTAL-SMD-5X3 = smd 1.9 x 1.1: 1 -1.85,-1.15; 2 1.85,-1.15; 3 1.85,1.15; 4 -1.85,1.15

### Placement (x,y rotation side)
B1  69.96,117.26 270 top
BATT1  92.56,92.56 90 bottom
C1  85.93,63.34 270 top
C2  44.26,94.56 0 top
C3  128.86,94.26 270 top
C4  90.76,41.06 90 top
C5  94.46,54.16 180 top
C6  142.76,90.66 180 top
C7  95.86,129.26 90 top
C8  94.56,146.06 270 top
C9  73.46,101.06 0 top
C10  113.26,86.96 270 top
C11  119.06,92.16 180 top
C12  80.86,113.66 0 top
C13  62.26,109.56 270 top
C16  119.06,90.06 180 top
C17  49.86,89.16 180 top
C18  66.26,116.76 180 top
C19  66.26,118.86 0 top
C20  88.66,90.06 270 top
C21  96.36,89.06 270 top
C22  91.76,88.46 0 top
C23  91.76,96.66 180 top
C24  66.76,101.26 0 top
C25  96.36,92.76 90 top
C26  84.66,106.76 270 top
C27  84.66,110.66 90 top
D1  28.56,90.96 270 top
D2  93.56,25.76 0 top
D3  159.16,92.96 90 top
D4  91.26,161.96 180 top
D5  72.19,72.31 0 bottom
D6  112.66,71.81 180 bottom
J1  71.96,90.06 0 top
J2  108.06,84.16 90 top
J3  122.96,100.76 90 top
JP1  81.96,63.36 180 top
JP2  62.76,62.66 90 top
NET_BRIDGE  112.46,94.06 180 top
Q1  54.36,92.16 90 top
Q2  95.36,49.86 180 top
Q3  133.56,94.36 270 top
Q4  89.66,139.76 0 top
Q5  100.46,66.96 270 top
Q6  85.06,77.76 180 top
R1  61.67,96.5 90 top
R2  120.46,95.06 0 top
R3  58.96,91.76 270 top
R4  125.96,94.36 90 top
R6  92.66,132.76 180 top
R7  56.06,88.86 180 top
R8  92.66,99.76 180 top
R9  105.76,74.06 270 top
R10  79.56,71.36 270 top
R12  88.66,99.76 0 top
R15  89.16,127.06 90 top
R16  91.86,56.96 0 top
R17  95.06,61.26 0 top
SW1  96.16,108.06 90 top
U1  69.76,108.86 270 top
U2  92.56,92.56 270 top
U$1  69.96,123.36 90 top
U$2  35.76,91.46 270 top
U$3  113.86,91.06 90 top
U$4  93.16,32.36 0 top
U$5  151.16,92.46 90 top
U$6  91.56,153.76 180 top
Y1  80.85,108.82 90 top

### Tracks (layer width: path | path; a pad name or v marks a point on that pad's centre or on a via)
3V  (via drill 0.38)
  Top 0.152: 91.23,94.35 90.96,94.08 U2.SDO_M 90.88,94.08 90.88,93.7 U2.CS_A/G 90.88,93.63 90.88,93.25 U2.CS_M 90.81,93.17 90.12,93.17 89.89,92.94 89.89,90.96 | 91.23,94.35 91.34,94.47 91.87,94.47 U2.SDO_A/G | 89.89,90.96 88.67,90.96 C20.1 88.6,90.88 87.68,89.97 87.68,88.67 87.99,88.37 89.36,88.37 89.44,88.45 90.81,88.45 C22.1 | 89.89,90.96 90.81,90.96 U2.DEN_A/G | U2.VDD@2 94.31,93.17 94.31,92.79 U2.VDD@1 94.39,92.79 96.98,92.79 97.36,93.17 97.36,94.08 96.98,94.47 95.68,94.47 95.38,94.16 94.31,94.16 | 94.31,94.16 U2.VDDIO@1 | U2.VDDIO@2 92.71,94.54 92.71,96.6 C23.1 92.64,96.68 92.64,97.67 91.72,98.58 91.72,99.72 R8.2 91.65,99.8 91.65,100.71 | 88.33,99.84 90.12,101.63 90.96,101.63 91.65,100.94 91.65,100.71 | 88.33,99.84 88.29,99.8 87.76,99.8 R12.1 | 94.31,94.16 94.31,100.41 94.01,100.71 91.65,100.71 | 88.86,96.71 88.37,97.21 88.37,99.8 88.33,99.84 | 88.86,96.71 91.23,94.35 | 73.78,107.69 73.28,108.18 73.28,109.55 73.82,110.09 74.58,110.09 U1.59 | 73.78,107.69 73.82,107.65 74.58,107.65 U1.54 | C9.1 72.52,101.09 72.52,102.16 71.53,103.15 71.53,103.91 U1.44 71.53,103.99 71.53,104.75 71.99,105.21 71.99,105.74 v72.9,106.66 73.74,107.5 73.74,107.65 73.78,107.69 | 65.93,102.58 66.5,103.15 66.5,103.91 U1.34 | 65.93,102.58 65.89,102.54 65.89,101.32 C24.1 | v111.23,90.12 112.52,90.12 U$3.5 | v61.78,94.31 61.7,94.39 61.7,95.53 R1.1 61.62,95.61 60.71,96.52 60.71,108.56 61.7,109.55 64.82,109.55 U1.23 | v121.29,92.18 119.99,92.18 C11.1 | v65.28,102.7 65.36,102.62 65.89,102.62 65.93,102.58 | v88.83,96.68 88.86,96.71
  Route2 0.152: v61.78,94.31 61.93,94.31
  pour Route2: 124.36,124.86 75.86,124.76 76.06,115.36 57.86,115.36 58.06,100.26 61.96,100.06 61.86,78.26 61.76,60.66 124.16,60.56
BAT_GND  (via drill 0.38, 0.6)
  Top 0.457: 108.64,91.11 107.19,92.56 BATT1.- | 108.64,91.11 109.1,90.66 109.1,90.35 113.21,86.24 113.21,86.08 C10.2 | C6.2 139.58,90.73 135.08,90.73 132.49,93.32 Q3.2S 132.26,93.47 129.06,93.47 C3.2 128.83,93.4 v127.38,93.4 126.01,93.4 R4.1 125.78,93.55 118.93,93.55 117.71,94.77 112.3,94.77 111.57,94.05 | 111.57,94.05 108.64,91.11 | Q5.2S 99.19,65.97 95.53,62.31 95.46,62.31 95,61.85 95,60.56 92.48,58.04 92.26,58.04 91.19,56.98 R16.1 90.96,56.9 v92.26,55.6 93.63,54.23 C5.2 93.7,54 94.39,53.32 94.39,51.18 Q2.2S 94.24,50.96 90.81,47.53 90.81,44.25 C4.2 | C7.2 95.84,130.2 93.63,132.41 93.63,132.72 R6.1 93.47,132.95 93.47,135.61 90.73,138.36 Q4.2S 90.66,138.59 90.66,138.89 v92.64,140.87 94.54,142.78 94.54,142.93 C8.2 | v47.68,89.21 48.9,89.21 C17.2 | v59.56,81.16 59.57,81.21 59.57,81.82 60.63,82.88 60.63,91.04 59.11,92.56 R3.1 58.96,92.79 55.98,92.79 55.68,93.09 Q1.2S 55.45,93.25 54.16,94.54 47.45,94.54 C2.2 | v76.71,79.07 84.1,79.07 Q6.2S | NET_BRIDGE.P$2 111.56,94.06 111.57,94.05
  Route15 0.457: v124.72,121.06 124.91,121.06
  Bottom 0.457: v76.71,79.07 61.62,79.07 59.57,81.13 v59.56,81.16 | v124.72,121.06 122.96,121.06 J3.9
  pour Route15 (rank 2): 56.66,97.96 29.56,97.96 29.56,87.86 57.46,87.86 57.46,57.56 87.96,57.56 87.96,26.56 97.06,26.56 97.06,57.66 127.56,57.66 127.56,88.06 157.26,88.06 157.26,97.36 127.76,97.36 127.76,127.76 97.16,127.76 97.16,162.86 87.56,162.86 87.86,125.56 124.86,125.36 124.66,59.96 61.26,60.06 61.26,99.46 56.66,99.46
FILTERED
  Top 0.457: R15.2 89.21,128.07 89.21,130.28 91.65,132.72 R6.2 | C7.1 95.84,128.37 91.72,132.49 R6.2 | Q4.1G 88.75,138.51 88.75,135.77 91.57,132.95 R6.2
GND  (via drill 0.38, 0.6)
  Top 0.152: U1.11 68.56,113.74 68.94,113.74 U1.10 69.01,113.67 69.01,112.98 69.28,112.72 | 70.42,112.87 70.23,112.68 69.32,112.68 69.28,112.72 | 70.42,112.87 70.46,112.91 70.46,113.67 U1.7 | 70.42,112.87 72.14,111.15 v73.13,111.15 74.58,111.15 U1.61 | C24.2 67.64,101.32 67.64,102.54 67.03,103.15 67.03,103.91 U1.35 66.96,103.99 66.96,104.83 66.77,105.02 | 66.77,105.02 66.73,105.06 66.27,105.06 66.04,104.83 66.04,103.99 U1.33 | C13.2 62.31,108.71 63.68,108.71 64.06,109.1 64.82,109.1 U1.24 64.9,109.17 65.74,109.17 65.85,109.29 | 65.85,110.89 65.89,110.85 65.89,109.32 65.85,109.29 | 65.85,110.89 65.66,111.08 64.9,111.08 U1.20 64.82,111.15 64.06,111.15 63.83,111.38 63.83,111.84 64.06,112.07 64.82,112.07 U1.18 64.9,112.14 64.9,112.6 U1.17 64.9,112.68 65.2,112.98 65.2,116.64 C18.2 | 66.77,105.02 66.8,105.06 66.8,107.11 67.26,107.57 67.26,108.18 66.2,109.25 65.89,109.25 65.85,109.29 | 69.28,112.72 69.24,112.68 69.24,112.3 67.87,110.92 65.89,110.92 65.85,110.89 | U1.55 74.58,108.18 73.82,108.18 73.59,108.41 73.59,109.32 73.82,109.55 74.58,109.55 U1.58 74.65,109.63 76.79,109.63 79.84,112.68 80.83,112.68 81.74,113.59 C12.2 | 85.63,110.32 85.63,110.62 84.71,111.53 C27.2 84.64,111.61 82.65,113.59 81.82,113.59 C12.2 | 85.63,110.32 85.63,107.19 84.71,106.28 84.71,105.9 C26.2 | 85.63,110.32 91.57,110.32 SW1.3 91.65,110.32 100.64,110.32 SW1.4 | v74.56,117.16 74.58,117.1 78.01,117.1 81.59,113.52 C12.2 | U2.GND@2 94.31,91.87 94.31,91.49 U2.GND@1 94.31,91.42 94.31,91.04 U2.RES@5 94.24,90.96 93.55,90.96 93.25,90.66 U2.RES@4 93.17,90.66 92.79,90.66 U2.RES@3
  Top 0.152: U2.RES@3 92.71,90.66 92.41,90.66 U2.RES@2 92.33,90.66 91.95,90.66 U2.RES@1 91.87,90.58 91.49,90.58 v90.88,89.97 90.12,89.21 88.67,89.21 C20.2 | U2.RES@3 92.71,90.58 92.71,88.52 C22.2 92.79,88.52 93.09,88.22 96.29,88.22 C21.2 96.29,88.29 97.36,89.36 97.36,90.43 96.37,91.42 96.37,91.8 C25.1 | C16.2 118.16,90.12 118.16,92.1 C11.2 118.09,92.1 116.33,92.1 115.88,92.56 114.51,92.56 114.28,92.33 114.28,91.11 | 114.28,91.11 115.12,91.11 U$3.2 | 114.28,91.11 112.22,91.11 111.69,91.65 111.69,92.41 v112.3,93.02 112.75,93.47 112.75,94.01 NET_BRIDGE.P$1 | U1.45 72.06,103.91 72.06,103.15 74.12,101.09 74.35,101.09 C9.2 74.42,101.02 74.42,91.34 J1.6 | v59.56,84.16 59.49,84.1 59.49,82.43 58.58,81.51 58.58,79.53 62.69,75.42 JP2.GND | v90.88,98.12 90.88,96.68 C23.2
  other vias: 63.16,117.16 63.16,119.16 72.96,119.36 74.56,119.36 72.96,117.16
  pour Route15: 124.36,124.86 75.86,124.76 76.06,115.36 57.86,115.36 58.06,100.26 61.96,100.06 61.86,78.26 61.76,60.66 124.16,60.56
  pour Route2: 75.36,120.36 61.56,120.36 61.56,115.96 75.36,115.96
  pour Top: 75.36,120.36 61.56,120.36 61.56,115.96 75.36,115.96
MISO
  Top 0.152: U1.39 69.01,103.91 69.01,102.31 73.13,98.2 73.13,90.81 72.29,89.97 70.61,89.97 69.47,88.83 J1.1
MOSI
  Top 0.152: U1.38 68.56,103.91 68.56,102.31 71.91,98.96 71.91,91.34 J1.4
N$1
  Top 0.152: C1.1 85.85,64.21 82.81,64.21 81.97,63.38 JP1.DTR
N$2  (via drill 0.38)
  Top 0.457: v112.6,67.26 112.37,67.03 101.78,67.03 Q5.3D
  Bottom 0.457: v112.6,67.26 112.6,69.01 115.34,71.76 D6.C
N$3  (via drill 0.38)
  Top 0.457: v107.19,73.05 105.82,73.05 R9.2
  Bottom 0.457: v107.19,73.05 108.71,73.05 109.93,71.83 D6.A
N$4  (via drill 0.38)
  Top 0.457: v75.8,78.08 77.32,76.56 85.02,76.56 Q6.3D
  Bottom 0.457: v75.8,78.08 73.66,78.08 69.55,73.97 69.55,72.37 D5.C
N$5
  Top 0.152: C27.1 84.64,109.71 82.88,109.71 82.65,109.48 80.9,109.48 79.76,110.62 Y1.3 79.68,110.62 78.23,109.17 74.65,109.17 U1.57
N$6  (via drill 0.38)
  Top 0.457: v78.08,70.46 79.53,70.46 R10.2
  Bottom 0.457: v78.08,70.46 76.79,70.46 74.96,72.29 D5.A
N$7
  cutout Route2: 57.76,127.76 75.16,127.76 75.16,120.96 57.76,120.96
  cutout Route15: 57.76,127.76 75.16,127.76 75.16,120.96 57.76,120.96
N$10
  Top 0.152: C12.1 79.91,113.59 78.39,113.59 75.42,110.62 74.65,110.62 U1.60
N$13
  Top 0.152: 64.79,110.51 64.82,110.54 U1.21 | 64.79,110.51 64.75,110.47 62.31,110.47 C13.1 | U1.22 64.82,110.16 64.82,110.47 64.79,110.51
N$14
  Top 0.152: C26.1 84.64,107.65 82.65,107.65 82.04,107.04 Y1.1 81.97,107.04 80.44,108.56 74.65,108.56 U1.56
N$15
  Top 0.152: U2.C1 94.31,93.7 96.29,93.7 C25.2
N$16
  Top 0.457: D1.A 28.63,89.36 35.64,89.36 35.72,89.44 U$2.V- 35.94,89.59 38.46,92.1 53.09,92.1 Q1.3D
N$17
  Top 0.152: U2.CAP 94.31,92.33 95,92.33 95.38,91.95 95.38,90.88 96.29,89.97 C21.1
N$21
  Top 0.152: B1.4 70.69,116.56 70.69,115.19 70.08,114.58 70.08,113.74 U1.8
N$22
  Top 0.152: B1.3 69.17,116.56 69.17,114.89 69.47,114.58 69.47,113.74 U1.9
N$23
  Top 0.457: BATT1.+ 107.19,89.97 107.19,87.61 108.03,86.77 J2.2
N$24
  Top 0.457: D3.A 151.39,94.62 151.23,94.47 U$5.V- 151.01,94.39 134.85,94.39 Q3.3D
N$25
  Top 0.152: B1.2 69.09,117.25 67.64,117.25 67.19,116.79 C18.1
N$29
  Top 0.457: D4.A 89.59,161.9 89.59,153.83 U$6.V- 89.66,153.6 89.66,141.02 Q4.3D
N$30
  Top 0.457: D2.A 95.23,25.81 95.23,32.29 U$4.V- 95.3,32.51 95.3,48.59 Q2.3D
N$31
  Top 0.457: R2.2 121.44,95.08 125.71,95.08 125.94,95.3 R4.2 126.16,95.23 128.83,95.23 C3.1 128.98,95.38 132.26,95.38 Q3.1G
N$32
  Top 0.152: U$3.4 112.6,92.03 113.52,92.03 114.66,93.17 118.62,93.17 119.15,92.64 119.15,90.88 119.92,90.12 C16.1
N$33
  Top 0.457: R3.2 55.98,90.81 55.76,91.04 Q1.1G 55.6,91.19 55.15,90.73 55.15,88.9 R7.2 54.99,89.21 50.8,89.21 C17.1
N$34
  Top 0.457: R17.2 95.99,61.24 95.99,60.18 92.94,57.13 R16.2 92.87,56.9 92.87,56.67 95.3,54.23 C5.1 95.38,53.93 96.29,53.01 96.29,51.18 Q2.1G
PB5  (via drill 0.38)
  Top 0.152: v58.19,89.66 57.43,88.9 57.05,88.9 R7.1 | v67.19,109.4 67.19,108.71 68.02,107.88 68.02,106.73 70.01,104.75 U1.41
  Bottom 0.152: v58.19,89.66 58.19,98.5 64.33,104.64 | 64.33,104.64 67.26,107.57 67.26,109.32 v67.19,109.4 | 64.33,104.64 61.93,107.04 61.93,107.72 67.64,113.44 122.89,113.44 J3.6
PB6  (via drill 0.38)
  Top 0.152: v71.15,105.51 70.54,104.9 70.54,103.99 U1.42 | v93.17,73.97 99.19,67.95 Q5.1G
  Bottom 0.152: v71.15,105.51 71.45,105.51 73.21,103.76 75.95,103.76 79.3,100.41 79.3,91.27 93.17,77.4 v93.17,73.97
PB7  (via drill 0.38)
  Top 0.152: v71.07,102.24 71.07,103.91 U1.43 | v76.71,90.81 76.71,90.66 86.01,81.36 86.01,79.07 Q6.1G
  Bottom 0.152: v71.07,102.24 71.07,96.45 v76.71,90.81
PE3
  Top 0.152: R15.1 89.21,126.09 108.79,126.09 122.89,111.99 123.42,111.99 124.03,111.38 124.03,109.48 122.96,108.41 J3.4 122.89,108.33 120.68,106.12 120.68,94.85 119.92,94.08 119.08,94.08 111.23,101.93 79,101.93 75.87,105.06 74.65,105.06 U1.49
PE4  (via drill 0.38)
  Top 0.152: v94.16,62.69 94.16,61.32 R17.1 | v77.17,104.9 76.48,105.59 74.65,105.59 U1.50
  Bottom 0.152: v94.16,62.69 94.16,72.29 101.97,80.1 | 101.97,80.1 107.42,85.55 109.78,85.55 124.03,99.8 124.03,104.75 122.96,105.82 J3.3 | 101.97,80.1 v77.17,104.9
PE5
  Top 0.152: 119.54,104.83 119.54,107.5 122.89,110.85 J3.5 | 119.54,104.83 119.54,95.08 R2.1 | 119.54,104.83 79.99,104.83 78.77,106.05 74.65,106.05 U1.51
RESET  (via drill 0.38)
  Top 0.152: SW1.2 100.64,105.82 91.65,105.82 SW1.1 91.57,105.82 v89.82,105.82 | v63.07,96.07 61.7,97.44 R1.2 | C1.2 85.85,62.39 82.65,62.39 82.43,62.16 76.41,62.16 75.57,62.99 75.57,77.17 74.5,78.23 74.5,88.75 J1.5 | v68.02,112.22 68.02,113.67 U1.12
  Bottom 0.152: J1.5 74.42,88.83 73.28,89.97 69.09,89.97 68.18,90.88 68.18,90.96 v63.07,96.07 63.15,96.07 68.02,100.94 68.02,108.71 | 68.02,108.71 v68.02,112.22 | v89.82,105.82 84.94,105.82 82.04,108.71 68.02,108.71
RFANT
  Top 0.457: C19.2 67.19,118.85 68.1,117.94 69.09,117.94 B1.1 69.32,118.09 69.32,119.38 69.93,119.99 U$1.FEED
RX0
  Top 0.152: U1.46 72.52,103.91 72.52,103.15 73.66,102.01 74.88,102.01 86.77,90.12 86.77,75.26 84.64,73.13 82.96,73.13 80.52,70.69 80.52,66.96 76.94,63.38 JP1.TXO
RX1
  Top 0.152: U1.27 64.82,107.57 64.06,107.57 63.6,107.11 63.6,107.04 63.53,106.96 63.53,96.75 63.99,96.29 63.99,69.01 62.77,67.8 JP2.TXO
SCK
  Top 0.152: U1.37 68.02,103.91 68.02,102.39 68.48,101.93 68.48,92.1 68.18,91.8 68.18,87.76 68.33,87.61 70.77,87.61 71.91,88.75 J1.3
SCL  (via drill 0.38)
  Top 0.152: 93.55,98.35 93.55,94.85 93.25,94.54 U2.SCL/SPC | 93.55,98.35 93.55,99.72 R8.1 | v66.42,107.88 65.74,108.56 64.9,108.56 U1.25 | 93.55,98.35 v93.09,98.35
  Route15 0.152: v68.86,107.88 v66.42,107.88
  Bottom 0.152: v68.86,107.88 82.43,107.88 91.95,98.35 v93.09,98.35 104.75,98.35 107.11,100.71 122.89,100.71 J3.1
SDA  (via drill 0.38)
  Top 0.152: U2.SDA/SDI/SDO 92.33,94.54 92.33,95.23 92.1,95.46 90.58,95.46 89.66,96.37 89.66,99.72 R12.2 89.66,99.8 v90.66,100.79 | v62.77,107.34 63.53,108.11 64.82,108.11 U1.26
  Bottom 0.152: v62.77,107.34 62.77,108.11 67.72,113.06 83.72,113.06 90.66,106.12 90.66,103.3 | v90.66,100.79 90.66,103.3 | 90.66,103.3 122.89,103.3 J3.2
TX0  (via drill 0.38)
  Top 0.152: v75.11,102.92 73.28,102.92 73.05,103.15 73.05,103.91 U1.47
  Bottom 0.152: v75.11,102.92 75.11,93.55 84.1,84.56 84.1,68.02 79.45,63.38 JP1.RXI
TX1
  Top 0.152: U1.28 64.82,107.04 64.06,107.04 63.83,106.81 63.83,98.35 64.44,97.74 64.44,66.88 JP2.RXI
VBAT  (via drill 0.38)
  Top 0.457: D4.C 92.87,161.9 92.87,154.13 92.56,153.83 U$6.V+ 92.71,153.6 94.54,151.77 94.54,149.25 C8.1 94.54,148.95 v94.54,147.2 | D3.C 159.16,91.34 151.31,91.34 151.23,91.42 U$5.V+ 151.01,91.34 150.4,90.73 145.9,90.73 C6.1 145.67,90.58 142.4,90.58 140.72,88.9 117.63,88.9 116.03,90.5 | 116.03,90.5 115.73,90.2 115.34,90.2 U$3.1 115.12,90.05 115.12,89.74 113.29,87.91 C10.1 113.36,87.68 114.35,86.69 114.35,85.47 113.06,84.18 108.11,84.18 J2.1 108.03,83.95 108.03,77.32 105.9,75.19 R9.1 105.74,74.96 92.79,74.96 90.12,72.29 89.13,72.29 | 116.03,90.5 116.18,90.66 116.18,91.49 115.73,91.95 115.19,91.95 U$3.3 | D1.C 28.63,92.56 35.64,92.56 35.72,92.48 U$2.V+ 35.94,92.56 37.93,94.54 41.13,94.54 C2.1 41.35,94.47 v43.11,94.47 | D2.C 91.95,25.81 91.95,32.13 92.1,32.29 U$4.V+ 92.03,32.51 90.81,33.73 90.81,37.93 C4.1 90.73,38.15 90.73,41.35 89.13,42.95 89.13,72.29 | v80.98,72.29 79.61,72.29 R10.1 | 89.13,72.29 v83.26,72.29
  Bottom 0.457: J2.1 108.11,84.18 109.1,84.18 124.49,99.57 124.49,116.18 122.96,117.71 122.96,118.47 J3.8 122.74,118.62 105.82,118.62 94.54,129.9 v94.54,147.2 | v83.26,72.29 v80.98,72.29 80.83,72.44 80.83,76.33 75.8,81.36 65.13,81.36 52.02,94.47 v43.11,94.47
  pour Route2 (rank 2): 56.66,97.96 29.56,97.96 29.56,87.86 57.46,87.86 57.46,57.56 87.96,57.56 87.96,26.56 97.06,26.56 97.06,57.66 127.56,57.66 127.56,88.06 157.26,88.06 157.26,97.36 127.76,97.36 127.76,127.76 97.16,127.76 97.16,162.86 87.56,162.86 87.86,125.56 124.86,125.36 124.66,59.96 61.26,60.06 61.26,99.46 56.66,99.46

### Text on the board
tPlace: 10 | 9 | 8 | 7 | 6 | 5 | 4 | 3 | 2 | 1